# Altium project yard-ice.PrjPCB
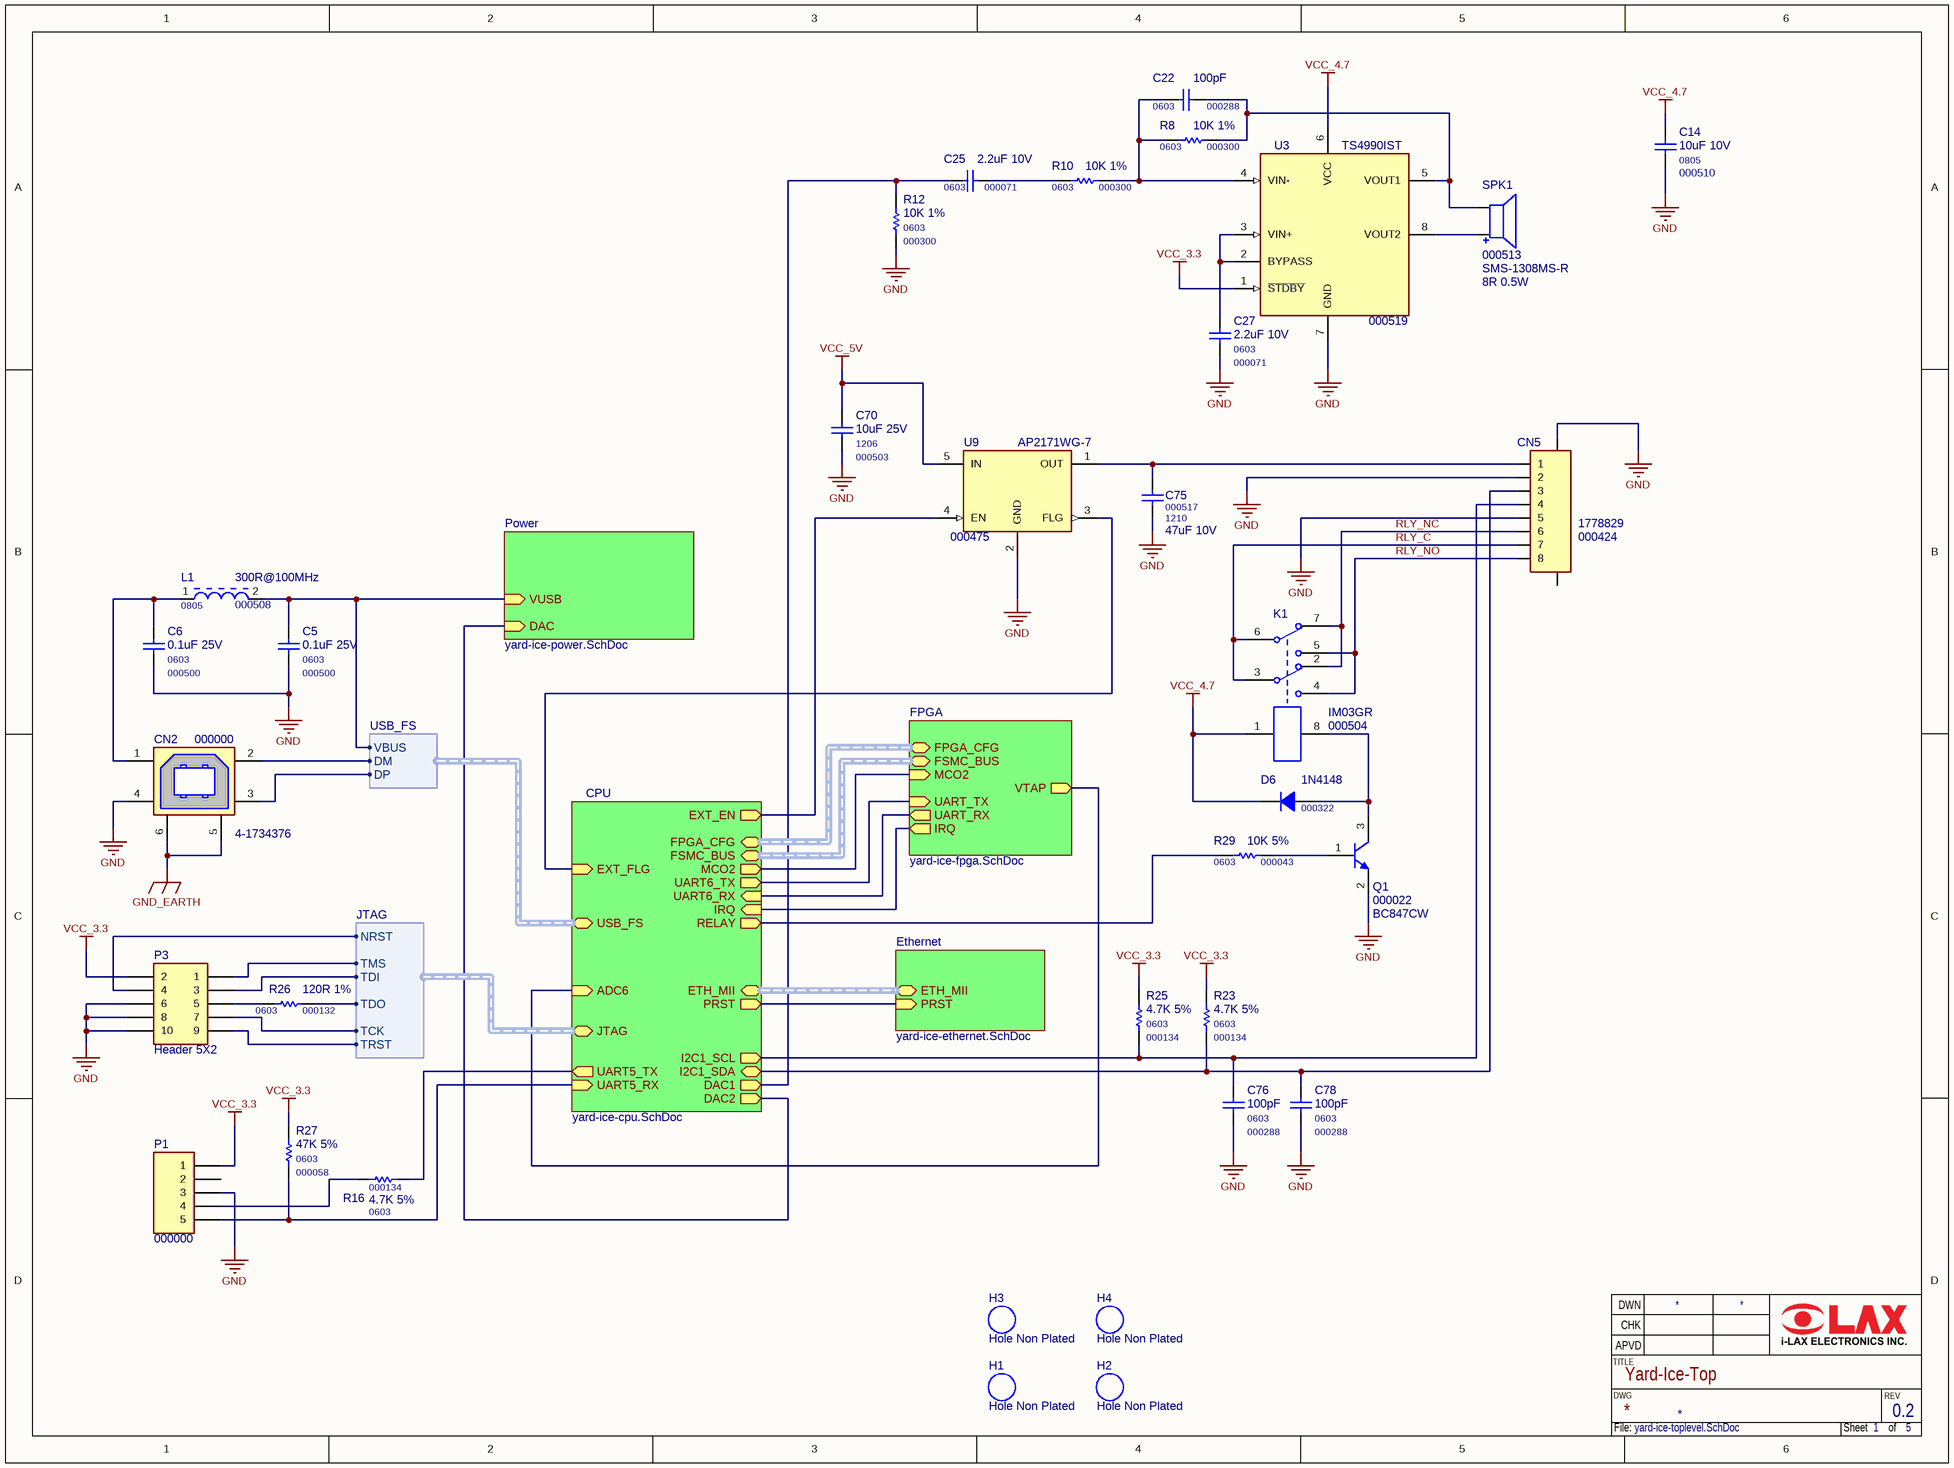
[diagram p0: yard-ice-toplevel.SchDoc]
5 sheets, 173 parts. Net scope: hierarchical (ports join the sheet entries above them; power ports are global).
Board file: yard-ice.PcbDoc
Sheets:
  yard-ice-toplevel.SchDoc
    Power = yard-ice-power.SchDoc
    CPU = yard-ice-cpu.SchDoc
    FPGA = yard-ice-fpga.SchDoc
    Ethernet = yard-ice-ethernet.SchDoc

## Sheet yard-ice-toplevel.SchDoc: Yard-Ice-Top
size 365 x 274 mm; Revision: 0.2; SheetNumber: 1; SheetTotal: 5

### Parts
C5  000500  value 0.1uF 25V  Package: 0603  [C0603M]
C6  000500  value 0.1uF 25V  Package: 0603  [C0603M]
C14  000510  value 10uF 10V  Package: 0805  [C0805M]
C22  000288  value 100pF  Package: 0603  [C0603M]
C25  000071  value 2.2uF 10V  Package: 0603  [C0603M]
C27  000071  value 2.2uF 10V  Package: 0603  [C0603M]
C70  000503  value 10uF 25V  Package: 1206  [C1206M]
C75  000517  value 47uF 10V  Package: 1210  [C1210M]
C76  000288  value 100pF  Package: 0603  [C0603M]
C78  000288  value 100pF  Package: 0603  [C0603M]
CN2  000000  value 4-1734376  [4-1734376]
CN5  000424  value 1778829  [1778829]
D6  000322  value 1N4148  [SOD-123]
H1  Hole Non Plated  [Hole NP 3.2x5.0x5.0]
H2  Hole Non Plated  [Hole NP 3.2x5.0x5.0]
H3  Hole Non Plated  [Hole NP 3.2x5.0x5.0]
H4  Hole Non Plated  [Hole NP 3.2x5.0x5.0]
K1  000504  value IM03GR  [Relay-10X6]
L1  000508  value 300R@100MHz  Package: 0805  [L0805M]
P1  000000  [TSW-105-07-G-S]
P3  Header 5X2  [TSW-105-07-G-D]
Q1  000022  value BC847CW  [SOT-323]
R8  000300  value 10K 1%  Package: 0603  [R0603M]
R10  000300  value 10K 1%  Package: 0603  [R0603M]
R12  000300  value 10K 1%  Package: 0603  [R0603M]
R16  000134  value 4.7K 5%  Package: 0603  [R0603M]
R23  000134  value 4.7K 5%  Package: 0603  [R0603M]
R25  000134  value 4.7K 5%  Package: 0603  [R0603M]
R26  000132  value 120R 1%  Package: 0603  [R0603M]
R27  000058  value 47K 5%  Package: 0603  [R0603M]
R29  000043  value 10K 5%  Package: 0603  [R0603M]
SPK1  000513  value 8R 0.5W  [SMS-1308MS-R]
U3  000519  value TS4990IST  [MiniSO-8M]
U9  000475  value AP2171WG-7  [SOT-25]

### Sub-sheets
CPU = yard-ice-cpu.SchDoc: ETH_MII (harness ETH_MII), FSMC_BUS (harness FSMC_BUS), FPGA_CFG (harness FPGA_CFG), PRST (out), MCO2 (out), USB_FS (harness USB_FS), JTAG (harness JTAG), EXT_EN (out), EXT_FLG (in), ADC6 (in), DAC2 (out), I2C1_SDA (bidir), I2C1_SCL (out), UART6_TX (out), UART6_RX (in), UART5_TX (out), UART5_RX (in), RELAY (out), IRQ (in), DAC1 (out)
Ethernet = yard-ice-ethernet.SchDoc: ETH_MII (harness ETH_MII), PRST (in)
FPGA = yard-ice-fpga.SchDoc: FSMC_BUS (harness FSMC_BUS), FPGA_CFG (harness FPGA_CFG), MCO2 (in), VTAP (out), UART_TX (in), UART_RX (out), IRQ (out)
Power = yard-ice-power.SchDoc: VUSB (in), DAC (in)

### Harnesses
USB_FS: VBUS, DM, DP
JTAG: TDO, TDI, TCK, TMS, TRST, NRST

### Nets
GND: C5.2 C6.2 C14.2 C27.2 C70.2 C75.2 C76.2 C78.2 CN2.4 CN5.2 CN5.5 CN5.9 P1.3 P3.6 P3.8 P3.10 Q1.2(E) R12.1 U3.7(GND) U9.2(GND)
GND_EARTH: CN2.5(SHIELD) CN2.6(SHIELD)
VCC_3.3: P1.1 P3.2 R23.2 R25.2 R27.2 U3.1(~{STDBY})
VCC_4.7: C14.1 D6.2(K) K1.1 U3.6(VCC)
VCC_5V: C70.1 U9.5(IN)
ADC12_IN6: sheet CPU/ADC6, sheet FPGA/VTAP
DAC1_OUT: C25.1 R12.2 ; sheet CPU/DAC1
DAC2_OUT: sheet Power/DAC, sheet CPU/DAC2
I2C1_SCL: C76.1 CN5.4 R25.1 ; sheet CPU/I2C1_SCL
I2C1_SDA: C78.1 CN5.3 R23.1 ; sheet CPU/I2C1_SDA
JTCK: P3.7 ; sheet CPU/JTAG.TCK
JTDI: P3.3 ; sheet CPU/JTAG.TDI
JTDO: R26.2 ; sheet CPU/JTAG.TDO
JTMS: P3.1 ; sheet CPU/JTAG.TMS
JTRST: P3.9 ; sheet CPU/JTAG.TRST
MCO2: sheet CPU/MCO2, sheet FPGA/MCO2
NRST: P3.4 ; sheet CPU/JTAG.NRST
OTG_FS_DM: CN2.2 ; sheet CPU/USB_FS.DM
OTG_FS_DP: CN2.3 ; sheet CPU/USB_FS.DP
OTG_FS_VBUS: C5.1 L1.2 ; sheet Power/VUSB, sheet CPU/USB_FS.VBUS
PD6: sheet CPU/IRQ, sheet FPGA/IRQ
PD11: U9.3(FLG) ; sheet CPU/EXT_FLG
PD12: U9.4(EN) ; sheet CPU/EXT_EN
PE5: sheet CPU/PRST, sheet Ethernet/PRST
RLY_C: CN5.7 K1.3 K1.6
RLY_NC: CN5.6 K1.2 K1.7
RLY_NO: CN5.8 K1.4 K1.5
SPI2_NSS: R29.2 ; sheet CPU/RELAY
USART5_RX: P1.5 R27.1 ; sheet CPU/UART5_RX
USART5_TX: R16.1 ; sheet CPU/UART5_TX
USART6_RX: sheet CPU/UART6_RX, sheet FPGA/UART_RX
USART6_TX: sheet CPU/UART6_TX, sheet FPGA/UART_TX
NetC6_1: C6.1 CN2.1 L1.1
NetC22_1: C22.1 R8.2 R10.1 U3.4(VIN-)
NetC22_2: C22.2 R8.1 SPK1.2 U3.5(VOUT1)
NetC25_2: C25.2 R10.2
NetC27_1: C27.1 U3.2(BYPASS) U3.3(VIN+)
NetC75_1: C75.1 CN5.1 U9.1(OUT)
NetD6_1: D6.1(A) K1.8 Q1.3(C)
NetP1_4: P1.4 R16.2
NetP3_5: P3.5 R26.1
NetQ1_1: Q1.1(B) R29.1
NetSPK1_1: SPK1.1 U3.8(VOUT2)

Not connected (* = marked no-connect by the designer): CN5 10; P1 2

### Buses and harness runs
harness sheet CPU/ETH_MII = sheet Ethernet/ETH_MII
harness sheet CPU/FPGA_CFG = sheet FPGA/FPGA_CFG
harness sheet CPU/FSMC_BUS = sheet FPGA/FSMC_BUS

### Notes on the sheet
- TITLE
- APVD
- DWN
- CHK
- DWG
- REV
- File:
- Sheet
- of

### Library data of the parts
C5 C6 = C0603: SMD Ceramic Chip Capacitor - 0603 - X7R; MF PN: C1608X7R1E104K; MF: TDK; PN: 000500
C14 = C0805: SMD Ceramic Chip Capacitor - 0805 - X7R; MF PN: C2012X7R1A106K; MF: TDK; PN: 000510
C22 C76 C78 = C0603: SMD Ceramic Chip Capacitor - 0603; PN: 000288
C25 = C0603: SMD Ceramic Chip Capacitor - 0603 - X7R; MF PN: LMK107B7225KA-T; MF: Taiyo Yuden; PN: 000071
C27 = C0603: SMD Ceramic Chip Capacitor - 0603 - X7R; MF: Taiyo Yuden; MF PN: LMK107B7225KA-T; PN: 000071
C70 = C1206: SMD Ceramic Chip Capacitor - 1206 - X7R; MF PN: TMK316B7106KL-TD; MF: Taiyo Yuden; PN: 000503
C75 = C12010: SMD Ceramic Chip Capacitor - 1210 - X7R; MF: Taiyo Yuden; MF PN: LMK325B7476MM-TR; PN: 000517
CN2 = 4-1734376: USB Type B - Right Angle - Thru Hole; MF: Tyco; PN: 000000; Package: PTH
CN5 = Combicon SMT 8: Terminal Block, Header, 8-Pos; MF: Phoenix Contacts; PN: 000424; Package: SMT
D6 = 1N4148W: Schottky Barrier Diode; MF: Diodes Inc; MF PN: 1N4148W-7-F; PN: 000322; Package: SOD-123
K1 = Relay-DPDT: Dual-Pole Dual-Throw Relay; MF: Tyco; PN: 000504; Package: SMT; MF PN: IM03GR
L1 = L0805: SMD Chip Inductor - 0805; MF PN: MMZ2012Y301B; MF: TDK; PN: 000508
P1 = Header 5: Header, 5-Pin; Value: 5x1; PN: 000000; Package: PTH
P3 = Header 5X2: Header 5-Pin, Dual row; PN: 000000; Package: PTH; Value: 5x2
Q1 = BC847CW: NPN General-purpose Transistor; MF: Diodes Inc; MF PN: BC847CW-7-F; PN: 000022; Package: SOT-323
R8 R10 R12 R16 R23 R25-R27 R29 = R0603: SMD Chip Resistor - 0603
  R8 R10 R12: PN: 000300
  R16 R23 R25: PN: 000134
  R26: PN: 000132
  R27: PN: 000058
  R29: PN: 000043
SPK1 = SMS-1308MS-R: Loudspeaker; MF: PUI-Audio; PN: 000513; Package: SMT; MF PN: SMS-1308MS-R
U3 = TS4990IST: 1.2 W audio power amplifier with active-low standby mode; PN: 000519; Package: TSSOP-8
U9 = AP2171W: 1A SINGLE CHANNEL CURRENT-LIMITED POWER  SWITCH; MF: Diodes Inc; Package: SOT23-5; PN: 000475

## Sheet yard-ice-power.SchDoc: Yard-Ice-Power
size 365 x 274 mm; Revision: 1.0; SheetNumber: 2; SheetTotal: 5
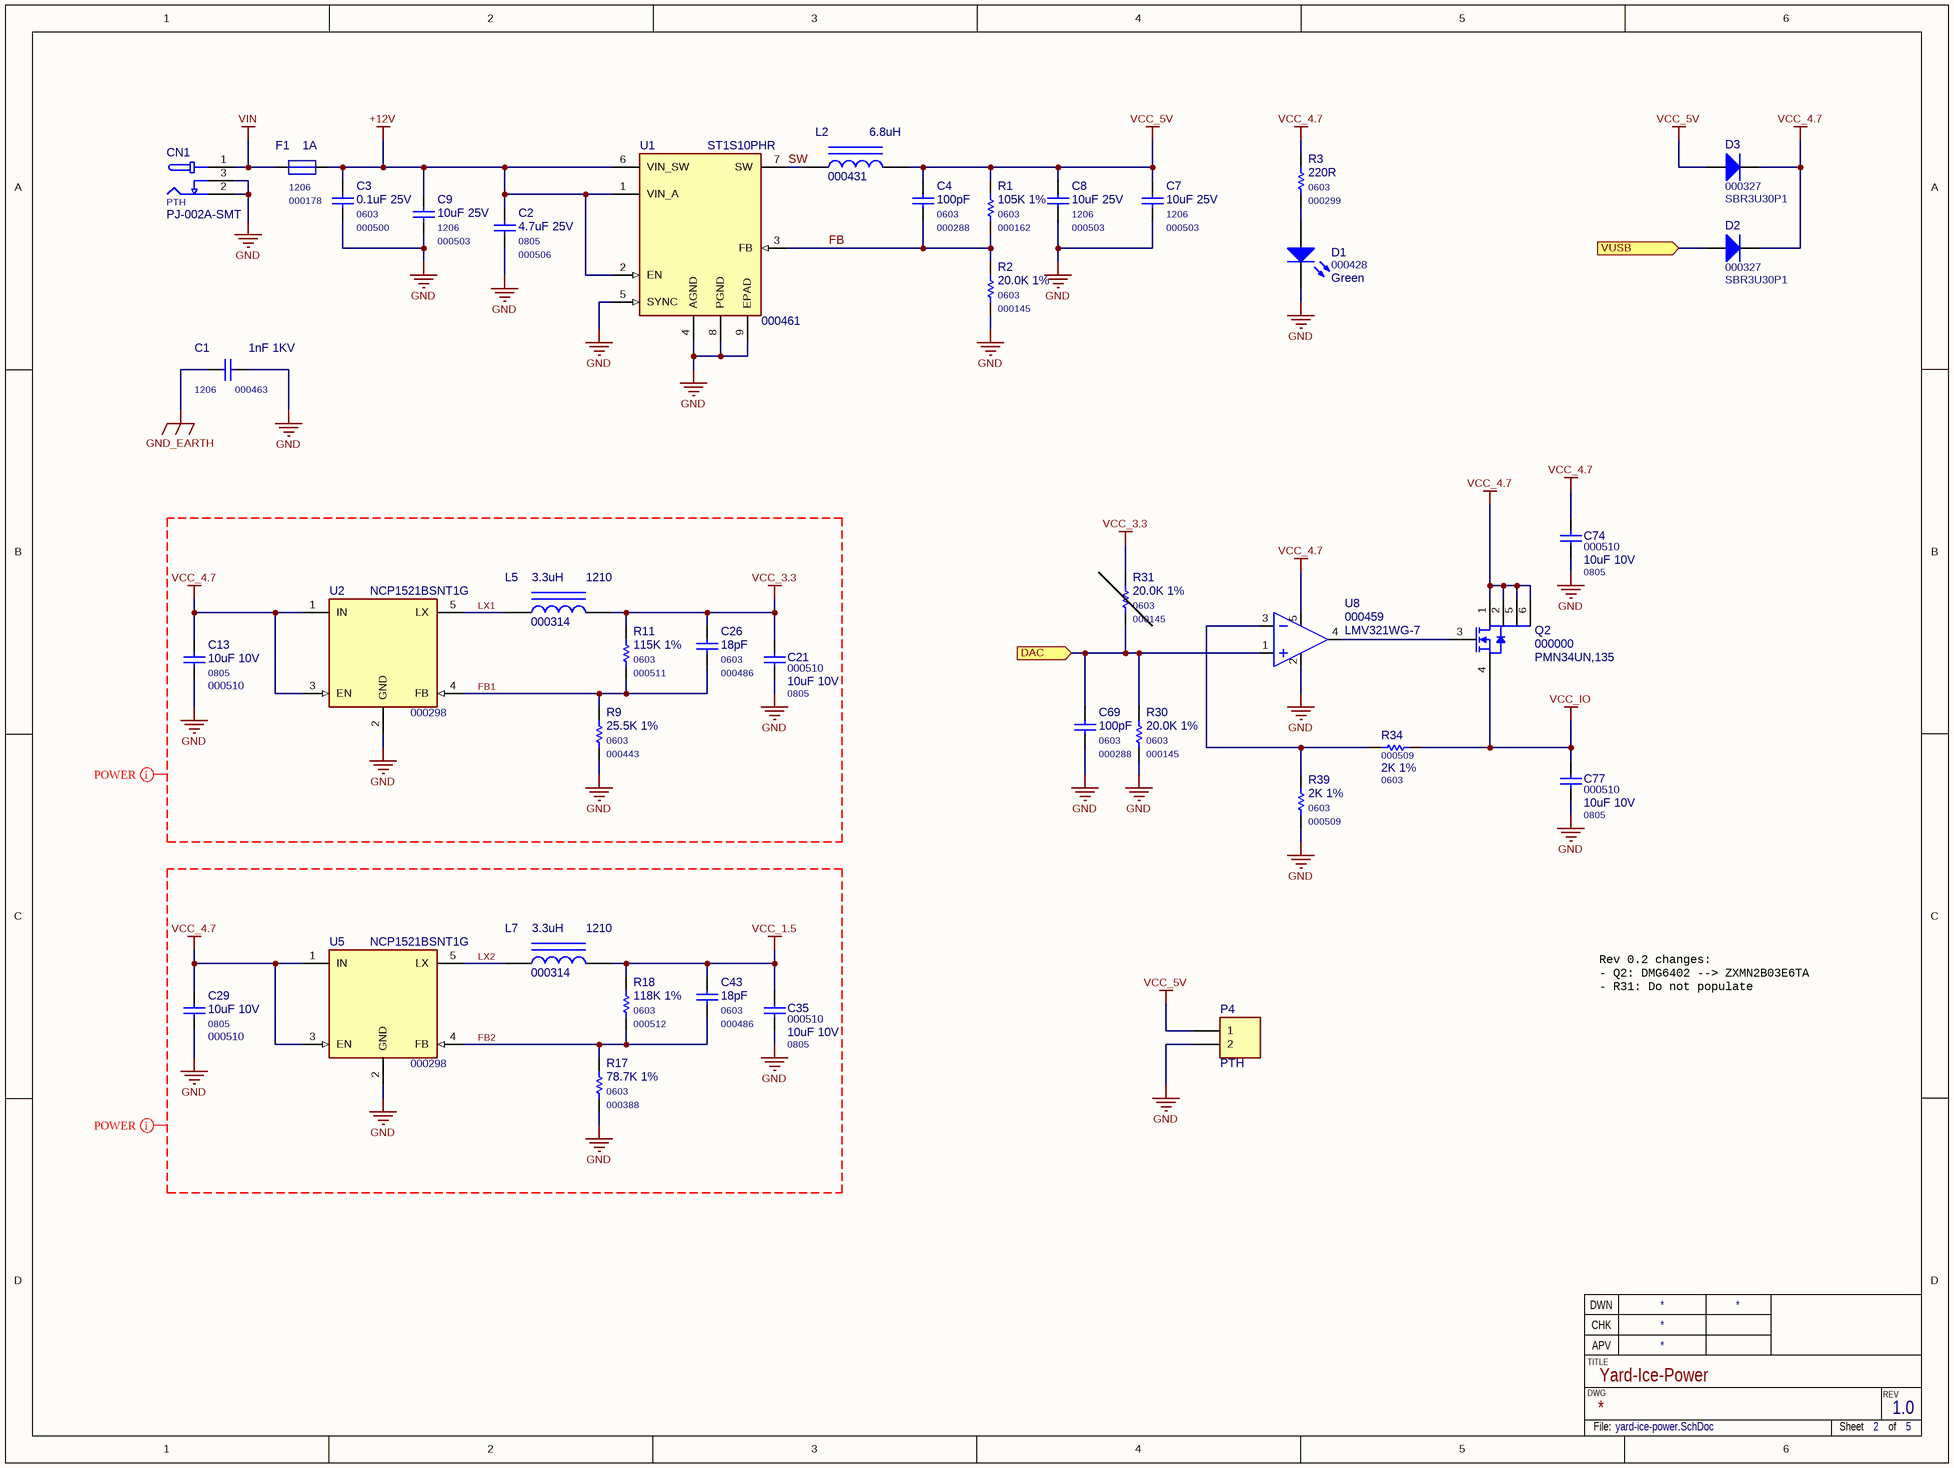
[diagram p1: yard-ice-power.SchDoc]

### Parts
C1  000463  value 1nF 1KV  Package: 1206  [C1206M]
C2  000506  value 4.7uF 25V  Package: 0805  [C0805M]
C3  000500  value 0.1uF 25V  Package: 0603  [C0603M]
C4  000288  value 100pF  Package: 0603  [C0603M]
C7  000503  value 10uF 25V  Package: 1206  [C1206M]
C8  000503  value 10uF 25V  Package: 1206  [C1206M]
C9  000503  value 10uF 25V  Package: 1206  [C1206M]
C13  000510  value 10uF 10V  Package: 0805  [C0805M]
C21  000510  value 10uF 10V  Package: 0805  [C0805M]
C26  000486  value 18pF  Package: 0603  [C0603M]
C29  000510  value 10uF 10V  Package: 0805  [C0805M]
C35  000510  value 10uF 10V  Package: 0805  [C0805M]
C43  000486  value 18pF  Package: 0603  [C0603M]
C69  000288  value 100pF  Package: 0603  [C0603M]
C74  000510  value 10uF 10V  Package: 0805  [C0805M]
C77  000510  value 10uF 10V  Package: 0805  [C0805M]
CN1  PTH  [PJ-002A-SMT]
D1  000428  value Green  [LED0805L LP]
D2  000327  value SBR3U30P1  [PowerDI 123]
D3  000327  value SBR3U30P1  [PowerDI 123]
F1  000178  value 1A  Package: 1206  [F1206L]
L2  000431  value 6.8uH  [L8.0MMX8.0MM]
L5  000314  value 3.3uH  Package: 1210  [L1210M]
L7  000314  value 3.3uH  Package: 1210  [L1210M]
P4  PTH  [TSW-102-07-G-S]
Q2  000000  value PMN34UN,135  [SOT-26]
R1  000162  value 105K 1%  Package: 0603  [R0603M]
R2  000145  value 20.0K 1%  Package: 0603  [R0603M]
R3  000299  value 220R  Package: 0603  [R0603M]
R9  000443  value 25.5K 1%  Package: 0603  [R0603M]
R11  000511  value 115K 1%  Package: 0603  [R0603M]
R17  000388  value 78.7K 1%  Package: 0603  [R0603M]
R18  000512  value 118K 1%  Package: 0603  [R0603M]
R30  000145  value 20.0K 1%  Package: 0603  [R0603M]
R31  000145  value 20.0K 1%  Package: 0603  [R0603M]
R34  000509  value 2K 1%  Package: 0603  [R0603M]
R39  000509  value 2K 1%  Package: 0603  [R0603M]
U1  000461  value ST1S10PHR  [PowerSO-8]
U2  000298  value NCP1521BSNT1G  [TSOP-5]
U5  000298  value NCP1521BSNT1G  [TSOP-5]
U8  000459  value LMV321WG-7  [SOT-25]

### Ports
DAC (in), VUSB (in)

### Nets
+12V: C2.1 C3.1 C9.1 F1.2 U1.1(VIN_A) U1.2(EN) U1.6(VIN_SW)
GND: C1.2 C2.2 C3.2 C7.2 C8.2 C9.2 C13.2 C21.2 C29.2 C35.2 C69.2 C74.2 C77.2 CN1.2 CN1.3 D1.2(K) P4.2 R2.1 R9.1 R17.1 R30.1 R39.1 U1.4(AGND) U1.5(SYNC) U1.8(PGND) U1.9(EPAD) U2.2(GND) U5.2(GND) U8.2(V-)
GND_EARTH: C1.1
VCC_1.5: C35.1 C43.1 L7.2 R18.2
VCC_3.3: C21.1 C26.1 L5.2 R11.2 R31.2
VCC_4.7: C13.1 C29.1 C74.1 D2.2(K) D3.2(K) Q2.1(D) Q2.2(D) Q2.5(D) Q2.6(D) R3.2 U2.1(IN) U2.3(EN) U5.1(IN) U5.3(EN) U8.5(V+)
VCC_5V: C4.1 C7.1 C8.1 D3.1(A) L2.2 P4.1 R1.2
VCC_IO: C77.1 Q2.4(S) R34.1
VIN: CN1.1 F1.1
DAC2_OUT: C69.1 R30.2 R31.1 U8.1(IN+) ; port DAC
FB: C4.2 R1.1 R2.2 U1.3(FB)
FB1: C26.2 R9.2 R11.1 U2.4(FB)
FB2: C43.2 R17.2 R18.1 U5.4(FB)
LX1: L5.1 U2.5(LX)
LX2: L7.1 U5.5(LX)
OTG_FS_VBUS: D2.1(A) ; port VUSB
SW: L2.1 U1.7(SW)
NetD1_1: D1.1(A) R3.1
NetQ2_3: Q2.3(G) U8.4(OUT)
NetR34_2: R34.2 R39.2 U8.3(IN-)

### Layout directives
net class POWER: FB1, FB2, GND, LX1, LX2, VCC_1.5, VCC_3.3, VCC_4.7

### Notes on the sheet
- Rev 0.2 changes:
  - Q2: DMG6402 --> ZXMN2B03E6TA
  - R31: Do not populate
- TITLE
- CHK
- DWN
- APV
- DWG
- REV
- File:
- Sheet
- of

### Library data of the parts
C1 = C1206: SMD Ceramic Chip Capacitor - 1206; PN: 000463
C2 = C0805: SMD Ceramic Chip Capacitor - 0805 - X7R; MF: Taiyo Yuden; MF PN: TMK212AB7475KG-T; PN: 000506
C3 = C0603: as C5 on sheet yard-ice-toplevel; PN: 000500
C4 C26 C43 C69 = C0603: SMD Ceramic Chip Capacitor - 0603
  C4 C69: PN: 000288
  C26 C43: PN: 000486
C7-C9 = C1206: as C70 on sheet yard-ice-toplevel; PN: 000503
C13 C21 C29 C35 = C0805: as C14 on sheet yard-ice-toplevel; PN: 000510
C74 C77 = C0805: SMD Ceramic Chip Capacitor - 0805 - X7R; MF PN: C2012X7R1A106K; PN: TDK; PN: 000510; MF: TDK
CN1 = PJ-002A-SMT: Low Voltage Power Supply Connector; MF: CUI INC; PN: PTH; MF PN: PJ-002A-SMT; Package: SMT; Value: PJ-002A-SMT
D1 = LED0805LP: LED SMD 0805; Package: 0805; PN: 000428
D2 D3 = SBR3U30P1: Super Barrier Rectifier; MF: Diodes Inc; PN: 000327; Package: PowerDI 123
F1 = F1206: SMD Fuse, 1A, Slow, 63VDC, 1206; MF: Bel Fuse Inc; MF PN: C1S 1; PN: 000178
L2 = L8.0X8.0: SMT Power Inductor 8.0X8.0mm; MF: Taiyo Yuden; MF PN: NRS8040T6R8NJGJ; PN: 000431; Package: 8.0x8.0mm
L5 L7 = L1210: SMD Wire Wound Inductor -  1210 (3225 metric); MF: Murata; MF PN: LQH32PN3R3NN0L; PN: 000314
P4 = Header 2: Header, 2-Pin; Value: 2x1; PN: PTH; Package: PTH
Q2 = PMN34UN,135: N-Channel MOSFET 30V 4.9A 6TSOP; PN: 000000; Package: SOT23-6; ExtraInfo: *
R1-R3 R9 R11 R17 R18 R30 R31 R34 R39 = R0603: SMD Chip Resistor - 0603
  R1: PN: 000162
  R2 R30 R31: PN: 000145
  R3: PN: 000299
  R9: PN: 000443
  R11: PN: 000511
  R17: PN: 000388
  R18: PN: 000512
  R34 R39: PN: 000509
U1 = ST1S10: 3A, 900kHZ, monolithic synchronous step-down regulator; MF: ST; PN: 000461; Package: SOIC-8
U2 U5 = NCP1521BSNT1G: 1.5 MHz, 600 mA Step-Down  DC-DC Converter; MF: ON Semiconductor; PN: 000298; Package: SOT-23-5
U8 = LMV321WG-7: General Purpose, Low Voltage, Rail-to-Rail Output Operational Amplifier; MF: Diodes Inc; Package: SOT25; PN: 000459

## Sheet yard-ice-cpu.SchDoc: Yard-Ice-CPU
size 365 x 274 mm; Revision: 0.2; SheetNumber: 3; SheetTotal: 5
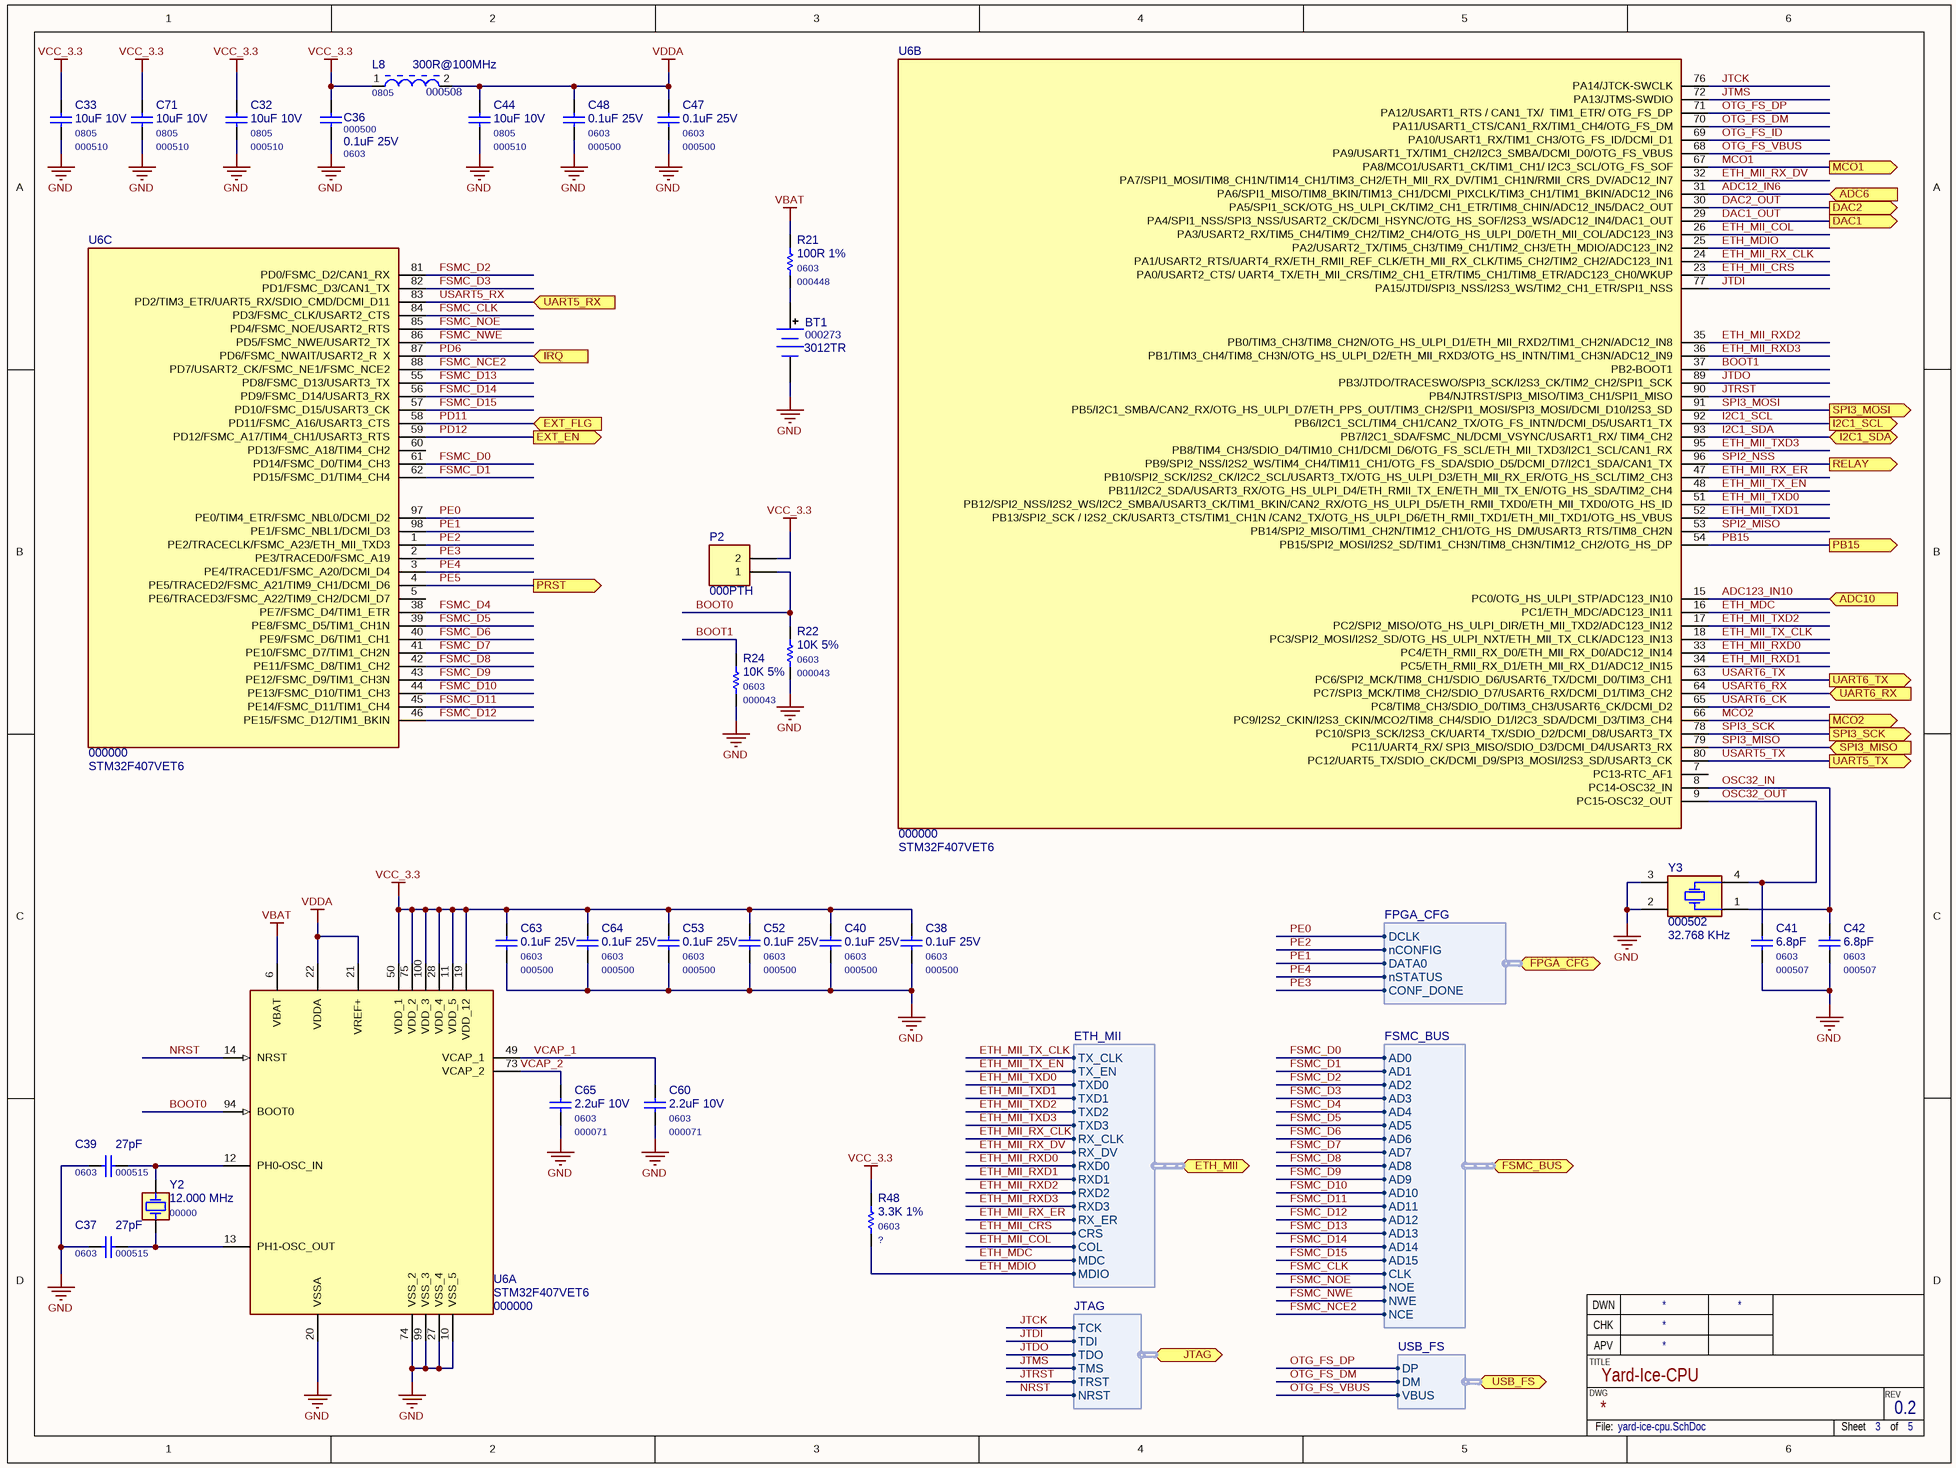
[diagram p2: yard-ice-cpu.SchDoc]

### Parts
BT1  000273  value 3012TR  [3012TR]
C32  000510  value 10uF 10V  Package: 0805  [C0805M]
C33  000510  value 10uF 10V  Package: 0805  [C0805M]
C36  000500  value 0.1uF 25V  Package: 0603  [C0603M]
C37  000515  value 27pF  Package: 0603  [C0603M]
C38  000500  value 0.1uF 25V  Package: 0603  [C0603M]
C39  000515  value 27pF  Package: 0603  [C0603M]
C40  000500  value 0.1uF 25V  Package: 0603  [C0603M]
C41  000507  value 6.8pF  Package: 0603  [C0603M]
C42  000507  value 6.8pF  Package: 0603  [C0603M]
C44  000510  value 10uF 10V  Package: 0805  [C0805M]
C47  000500  value 0.1uF 25V  Package: 0603  [C0603M]
C48  000500  value 0.1uF 25V  Package: 0603  [C0603M]
C52  000500  value 0.1uF 25V  Package: 0603  [C0603M]
C53  000500  value 0.1uF 25V  Package: 0603  [C0603M]
C60  000071  value 2.2uF 10V  Package: 0603  [C0603M]
C63  000500  value 0.1uF 25V  Package: 0603  [C0603M]
C64  000500  value 0.1uF 25V  Package: 0603  [C0603M]
C65  000071  value 2.2uF 10V  Package: 0603  [C0603M]
C71  000510  value 10uF 10V  Package: 0805  [C0805M]
L8  000508  value 300R@100MHz  Package: 0805  [L0805M]
P2  000PTH  [TSW-102-07-G-S]
R21  000448  value 100R 1%  Package: 0603  [R0603M]
R22  000043  value 10K 5%  Package: 0603  [R0603M]
R24  000043  value 10K 5%  Package: 0603  [R0603M]
R48  ?  value 3.3K 1%  Package: 0603  [R0603M]
U6  000000  value STM32F407VET6  [LQFP100]  (parts A,B,C of 3)
Y2  00000  value 12.000 MHz  [ABM3-H]
Y3  000502  value 32.768 KHz  [ABS25]

### Ports
ADC6 (in), ADC10 (in), DAC1 (out), DAC2 (out), ETH_MII (harness ETH_MII), EXT_EN (out), EXT_FLG (in), FPGA_CFG (harness FPGA_CFG), FSMC_BUS (harness FSMC_BUS), I2C1_SCL (out), I2C1_SDA (bidir), IRQ (in), JTAG (harness JTAG), MCO1 (out), MCO2 (out), PB15 (out), PRST (out), RELAY (out), SPI3_MISO (in), SPI3_MOSI (out), SPI3_SCK (out), UART5_RX (in), UART5_TX (out), UART6_RX (in), UART6_TX (out), USB_FS (harness USB_FS)

### Harnesses
ETH_MII: TX_CLK, TX_EN, TXD0, TXD1, TXD2, TXD3, RX_CLK, RX_DV, RXD0, RXD1, RXD2, RXD3, RX_ER, CRS, COL, MDC, MDIO
FSMC_BUS: AD0, AD1, AD2, AD3, AD4, AD5, AD6, AD7, AD8, AD9, AD10, AD11, AD12, AD13, AD14, AD15, CLK, NOE, NWE, NCE
FPGA_CFG: CONF_DONE, nSTATUS, DATA0, nCONFIG, DCLK
USB_FS: VBUS, DM, DP
JTAG: TDO, TDI, TCK, TMS, TRST, NRST

### Nets
GND: BT1.2(-) C32.2 C33.2 C36.2 C37.1 C38.2 C39.1 C40.2 C41.1 C42.1 C44.2 C47.2 C48.2 C52.2 C53.2 C60.2 C63.2 C64.2 C65.2 C71.2 R22.1 R24.1 U6.10(VSS_5) U6.20(VSSA) U6.27(VSS_4) U6.74(VSS_2) U6.99(VSS_3) Y3.2 Y3.3
VBAT: R21.2 U6.6(VBAT)
VCC_3.3: C32.1 C33.1 C36.1 C38.1 C40.1 C52.1 C53.1 C63.1 C64.1 C71.1 L8.1 P2.2 R48.2 U6.11(VDD_5) U6.19(VDD_12) U6.28(VDD_4) U6.50(VDD_1) U6.75(VDD_2) U6.100(VDD_3)
VDDA: C44.1 C47.1 C48.1 L8.2 U6.21(VREF+) U6.22(VDDA)
ADC12_IN6: U6.31(PA6/SPI1_MISO/TIM8_BKIN/TIM13_CH1/DCMI_PIXCLK/TIM3_CH1/TIM1_BKIN/ADC12_IN6) ; port ADC6
ADC123_IN10: U6.15(PC0/OTG_HS_ULPI_STP/ADC123_IN10) ; port ADC10
BOOT0: P2.1 R22.2 U6.94(BOOT0)
BOOT1: R24.2 U6.37(PB2-BOOT1)
DAC1_OUT: U6.29(PA4/SPI1_NSS/SPI3_NSS/USART2_CK/DCMI_HSYNC/OTG_HS_SOF/I2S3_WS/ADC12_IN4/DAC1_OUT) ; port DAC1
DAC2_OUT: U6.30(PA5/SPI1_SCK/OTG_HS_ULPI_CK/TIM2_CH1_ETR/TIM8_CHIN/ADC12_IN5/DAC2_OUT) ; port DAC2
ETH_MDC: U6.16(PC1/ETH_MDC/ADC123_IN11) ; port ETH_MII.MDC
ETH_MDIO: R48.1 U6.25(PA2/USART2_TX/TIM5_CH3/TIM9_CH1/TIM2_CH3/ETH_MDIO/ADC123_IN2) ; port ETH_MII.MDIO
ETH_MII_COL: U6.26(PA3/USART2_RX/TIM5_CH4/TIM9_CH2/TIM2_CH4/OTG_HS_ULPI_D0/ETH_MII_COL/ADC123_IN3) ; port ETH_MII.COL
ETH_MII_CRS: U6.23(PA0/USART2_CTS/_UART4_TX/ETH_MII_CRS/TIM2_CH1_ETR/TIM5_CH1/TIM8_ETR/ADC123_CH0/WKUP) ; port ETH_MII.CRS
ETH_MII_RX_CLK: U6.24(PA1/USART2_RTS/UART4_RX/ETH_RMII_REF_CLK/ETH_MII_RX_CLK/TIM5_CH2/TIM2_CH2/ADC123_IN1) ; port ETH_MII.RX_CLK
ETH_MII_RX_DV: U6.32(PA7/SPI1_MOSI/TIM8_CH1N/TIM14_CH1/TIM3_CH2/ETH_MII_RX_DV/TIM1_CH1N/RMII_CRS_DV/ADC12_IN7) ; port ETH_MII.RX_DV
ETH_MII_RX_ER: U6.47(PB10/SPI2_SCK/I2S2_CK/I2C2_SCL/USART3_TX/OTG_HS_ULPI_D3/ETH_MII_RX_ER/OTG_HS_SCL/TIM2_CH3) ; port ETH_MII.RX_ER
ETH_MII_RXD0: U6.33(PC4/ETH_RMII_RX_D0/ETH_MII_RX_D0/ADC12_IN14) ; port ETH_MII.RXD0
ETH_MII_RXD1: U6.34(PC5/ETH_RMII_RX_D1/ETH_MII_RX_D1/ADC12_IN15) ; port ETH_MII.RXD1
ETH_MII_RXD2: U6.35(PB0/TIM3_CH3/TIM8_CH2N/OTG_HS_ULPI_D1/ETH_MII_RXD2/TIM1_CH2N/ADC12_IN8) ; port ETH_MII.RXD2
ETH_MII_RXD3: U6.36(PB1/TIM3_CH4/TIM8_CH3N/OTG_HS_ULPI_D2/ETH_MII_RXD3/OTG_HS_INTN/TIM1_CH3N/ADC12_IN9) ; port ETH_MII.RXD3
ETH_MII_TX_CLK: U6.18(PC3/SPI2_MOSI/I2S2_SD/OTG_HS_ULPI_NXT/ETH_MII_TX_CLK/ADC123_IN13) ; port ETH_MII.TX_CLK
ETH_MII_TX_EN: U6.48(PB11/I2C2_SDA/USART3_RX/OTG_HS_ULPI_D4/ETH_RMII_TX_EN/ETH_MII_TX_EN/OTG_HS_SDA/TIM2_CH4) ; port ETH_MII.TX_EN
ETH_MII_TXD0: U6.51(PB12/SPI2_NSS/I2S2_WS/I2C2_SMBA/USART3_CK/TIM1_BKIN/CAN2_RX/OTG_HS_ULPI_D5/ETH_RMII_TXD0/ETH_MII_TXD0/OTG_HS_ID) ; port ETH_MII.TXD0
ETH_MII_TXD1: U6.52(PB13/SPI2_SCK_/_I2S2_CK/USART3_CTS/TIM1_CH1N_/CAN2_TX/OTG_HS_ULPI_D6/ETH_RMII_TXD1/ETH_MII_TXD1/OTG_HS_VBUS) ; port ETH_MII.TXD1
ETH_MII_TXD2: U6.17(PC2/SPI2_MISO/OTG_HS_ULPI_DIR/ETH_MII_TXD2/ADC123_IN12) ; port ETH_MII.TXD2
ETH_MII_TXD3: U6.95(PB8/TIM4_CH3/SDIO_D4/TIM10_CH1/DCMI_D6/OTG_FS_SCL/ETH_MII_TXD3/I2C1_SCL/CAN1_RX) ; port ETH_MII.TXD3
FSMC_CLK: U6.84(PD3/FSMC_CLK/USART2_CTS) ; port FSMC_BUS.CLK
FSMC_D0: U6.61(PD14/FSMC_D0/TIM4_CH3) ; port FSMC_BUS.AD0
FSMC_D1: U6.62(PD15/FSMC_D1/TIM4_CH4) ; port FSMC_BUS.AD1
FSMC_D2: U6.81(PD0/FSMC_D2/CAN1_RX) ; port FSMC_BUS.AD2
FSMC_D3: U6.82(PD1/FSMC_D3/CAN1_TX) ; port FSMC_BUS.AD3
FSMC_D4: U6.38(PE7/FSMC_D4/TIM1_ETR) ; port FSMC_BUS.AD4
FSMC_D5: U6.39(PE8/FSMC_D5/TIM1_CH1N) ; port FSMC_BUS.AD5
FSMC_D6: U6.40(PE9/FSMC_D6/TIM1_CH1) ; port FSMC_BUS.AD6
FSMC_D7: U6.41(PE10/FSMC_D7/TIM1_CH2N) ; port FSMC_BUS.AD7
FSMC_D8: U6.42(PE11/FSMC_D8/TIM1_CH2) ; port FSMC_BUS.AD8
FSMC_D9: U6.43(PE12/FSMC_D9/TIM1_CH3N) ; port FSMC_BUS.AD9
FSMC_D10: U6.44(PE13/FSMC_D10/TIM1_CH3) ; port FSMC_BUS.AD10
FSMC_D11: U6.45(PE14/FSMC_D11/TIM1_CH4) ; port FSMC_BUS.AD11
FSMC_D12: U6.46(PE15/FSMC_D12/TIM1_BKIN) ; port FSMC_BUS.AD12
FSMC_D13: U6.55(PD8/FSMC_D13/USART3_TX) ; port FSMC_BUS.AD13
FSMC_D14: U6.56(PD9/FSMC_D14/USART3_RX) ; port FSMC_BUS.AD14
FSMC_D15: U6.57(PD10/FSMC_D15/USART3_CK) ; port FSMC_BUS.AD15
FSMC_NCE2: U6.88(PD7/USART2_CK/FSMC_NE1/FSMC_NCE2) ; port FSMC_BUS.NCE
FSMC_NOE: U6.85(PD4/FSMC_NOE/USART2_RTS) ; port FSMC_BUS.NOE
FSMC_NWE: U6.86(PD5/FSMC_NWE/USART2_TX) ; port FSMC_BUS.NWE
I2C1_SCL: U6.92(PB6/I2C1_SCL/TIM4_CH1/CAN2_TX/OTG_FS_INTN/DCMI_D5/USART1_TX) ; port I2C1_SCL
I2C1_SDA: U6.93(PB7/I2C1_SDA/FSMC_NL/DCMI_VSYNC/USART1_RX/_TIM4_CH2) ; port I2C1_SDA
JTCK: U6.76(PA14/JTCK-SWCLK) ; port JTAG.TCK
JTDI: U6.77(PA15/JTDI/SPI3_NSS/I2S3_WS/TIM2_CH1_ETR/SPI1_NSS) ; port JTAG.TDI
JTDO: U6.89(PB3/JTDO/TRACESWO/SPI3_SCK/I2S3_CK/TIM2_CH2/SPI1_SCK) ; port JTAG.TDO
JTMS: U6.72(PA13/JTMS-SWDIO) ; port JTAG.TMS
JTRST: U6.90(PB4/NJTRST/SPI3_MISO/TIM3_CH1/SPI1_MISO) ; port JTAG.TRST
MCO1: U6.67(PA8/MCO1/USART1_CK/TIM1_CH1/_I2C3_SCL/OTG_FS_SOF) ; port MCO1
MCO2: U6.66(PC9/I2S2_CKIN/I2S3_CKIN/MCO2/TIM8_CH4/SDIO_D1/I2C3_SDA/DCMI_D3/TIM3_CH4) ; port MCO2
NRST: U6.14(NRST) ; port JTAG.NRST
OSC32_IN: C42.2 U6.8(PC14-OSC32_IN) Y3.1
OSC32_OUT: C41.2 U6.9(PC15-OSC32_OUT) Y3.4
OTG_FS_DM: U6.70(PA11/USART1_CTS/CAN1_RX/TIM1_CH4/OTG_FS_DM) ; port USB_FS.DM
OTG_FS_DP: U6.71(PA12/USART1_RTS_/_CAN1_TX/__TIM1_ETR/_OTG_FS_DP) ; port USB_FS.DP
OTG_FS_ID: U6.69(PA10/USART1_RX/TIM1_CH3/OTG_FS_ID/DCMI_D1)
OTG_FS_VBUS: U6.68(PA9/USART1_TX/TIM1_CH2/I2C3_SMBA/DCMI_D0/OTG_FS_VBUS) ; port USB_FS.VBUS
PB15: U6.54(PB15/SPI2_MOSI/I2S2_SD/TIM1_CH3N/TIM8_CH3N/TIM12_CH2/OTG_HS_DP) ; port PB15
PD6: U6.87(PD6/FSMC_NWAIT/USART2_R__X) ; port IRQ
PD11: U6.58(PD11/FSMC_A16/USART3_CTS) ; port EXT_FLG
PD12: U6.59(PD12/FSMC_A17/TIM4_CH1/USART3_RTS) ; port EXT_EN
PE0: U6.97(PE0/TIM4_ETR/FSMC_NBL0/DCMI_D2) ; port FPGA_CFG.DCLK
PE1: U6.98(PE1/FSMC_NBL1/DCMI_D3) ; port FPGA_CFG.DATA0
PE2: U6.1(PE2/TRACECLK/FSMC_A23/ETH_MII_TXD3) ; port FPGA_CFG.nCONFIG
PE3: U6.2(PE3/TRACED0/FSMC_A19) ; port FPGA_CFG.CONF_DONE
PE4: U6.3(PE4/TRACED1/FSMC_A20/DCMI_D4) ; port FPGA_CFG.nSTATUS
PE5: U6.4(PE5/TRACED2/FSMC_A21/TIM9_CH1/DCMI_D6) ; port PRST
SPI2_MISO: U6.53(PB14/SPI2_MISO/TIM1_CH2N/TIM12_CH1/OTG_HS_DM/USART3_RTS/TIM8_CH2N)
SPI2_NSS: U6.96(PB9/SPI2_NSS/I2S2_WS/TIM4_CH4/TIM11_CH1/OTG_FS_SDA/SDIO_D5/DCMI_D7/I2C1_SDA/CAN1_TX) ; port RELAY
SPI3_MISO: U6.79(PC11/UART4_RX/_SPI3_MISO/SDIO_D3/DCMI_D4/USART3_RX) ; port SPI3_MISO
SPI3_MOSI: U6.91(PB5/I2C1_SMBA/CAN2_RX/OTG_HS_ULPI_D7/ETH_PPS_OUT/TIM3_CH2/SPI1_MOSI/SPI3_MOSI/DCMI_D10/I2S3_SD) ; port SPI3_MOSI
SPI3_SCK: U6.78(PC10/SPI3_SCK/I2S3_CK/UART4_TX/SDIO_D2/DCMI_D8/USART3_TX) ; port SPI3_SCK
USART5_RX: U6.83(PD2/TIM3_ETR/UART5_RX/SDIO_CMD/DCMI_D11) ; port UART5_RX
USART5_TX: U6.80(PC12/UART5_TX/SDIO_CK/DCMI_D9/SPI3_MOSI/I2S3_SD/USART3_CK) ; port UART5_TX
USART6_CK: U6.65(PC8/TIM8_CH3/SDIO_D0/TIM3_CH3/USART6_CK/DCMI_D2)
USART6_RX: U6.64(PC7/SPI3_MCK/TIM8_CH2/SDIO_D7/USART6_RX/DCMI_D1/TIM3_CH2) ; port UART6_RX
USART6_TX: U6.63(PC6/SPI2_MCK/TIM8_CH1/SDIO_D6/USART6_TX/DCMI_D0/TIM3_CH1) ; port UART6_TX
VCAP_1: C60.1 U6.49(VCAP_1)
VCAP_2: C65.1 U6.73(VCAP_2)
NetBT1_1: BT1.1(+) R21.1
NetC37_2: C37.2 U6.13(PH1-OSC_OUT) Y2.2
NetC39_2: C39.2 U6.12(PH0-OSC_IN) Y2.1

Not connected (* = marked no-connect by the designer): U6 5(PE6/TRACED3/FSMC_A22/TIM9_CH2/DCMI_D7) 7(PC13-RTC_AF1) 60(PD13/FSMC_A18/TIM4_CH2)

### Notes on the sheet
- TITLE
- CHK
- DWN
- APV
- DWG
- REV
- File:
- Sheet
- of

### Library data of the parts
BT1 = 3012TR: CR1620 SMD Battery Holder; MF: Kestone; PN: 000273; Package: SMT
C32 C33 C71 = C0805: as C74 on sheet yard-ice-power; PN: 000510; MF: TDK
C36 C38 C40 C47 C48 C52 C53 C63 C64 = C0603: as C5 on sheet yard-ice-toplevel; PN: 000500
C37 C39 C41 C42 = C0603: SMD Ceramic Chip Capacitor - 0603
  C37 C39: PN: 000515
  C41 C42: PN: 000507
C44 = C0805: as C14 on sheet yard-ice-toplevel; PN: 000510
C60 C65 = C0603: as C27 on sheet yard-ice-toplevel; PN: 000071
L8 = L0805: SMD Ferrite Bead 0805; MF PN: MMZ2012Y301B; MF: TDK; PN: 000508
P2 = Header 2: Header, 2-Pin; Value: 2x1; PN: 000PTH; Package: PTH
R21 R22 R24 R48 = R0603: SMD Chip Resistor - 0603
  R21: PN: 000448
  R22 R24: PN: 000043
  R48: PN: ?
U6 = STM32F407VET6: Package: LQFP100; PN: 000000; ExtraInfo: *
Y2 = ABM3: Miniature Ceramic SMD Crystal; MF: Abracon; MF PN: ABM3-12.000MHZ-B2-T; Package: ABM3; PN: 00000
Y3 = ABS25: SMD Low Frequency Crystal; MF: Abracon; MF PN: ABS25-32.768KHZ-T; PN: 000502; Package: ABS25

## Sheet yard-ice-fpga.SchDoc: Yard-Ice-FPGA
size 365 x 274 mm; Revision: 0.2; SheetNumber: 4; SheetTotal: 5
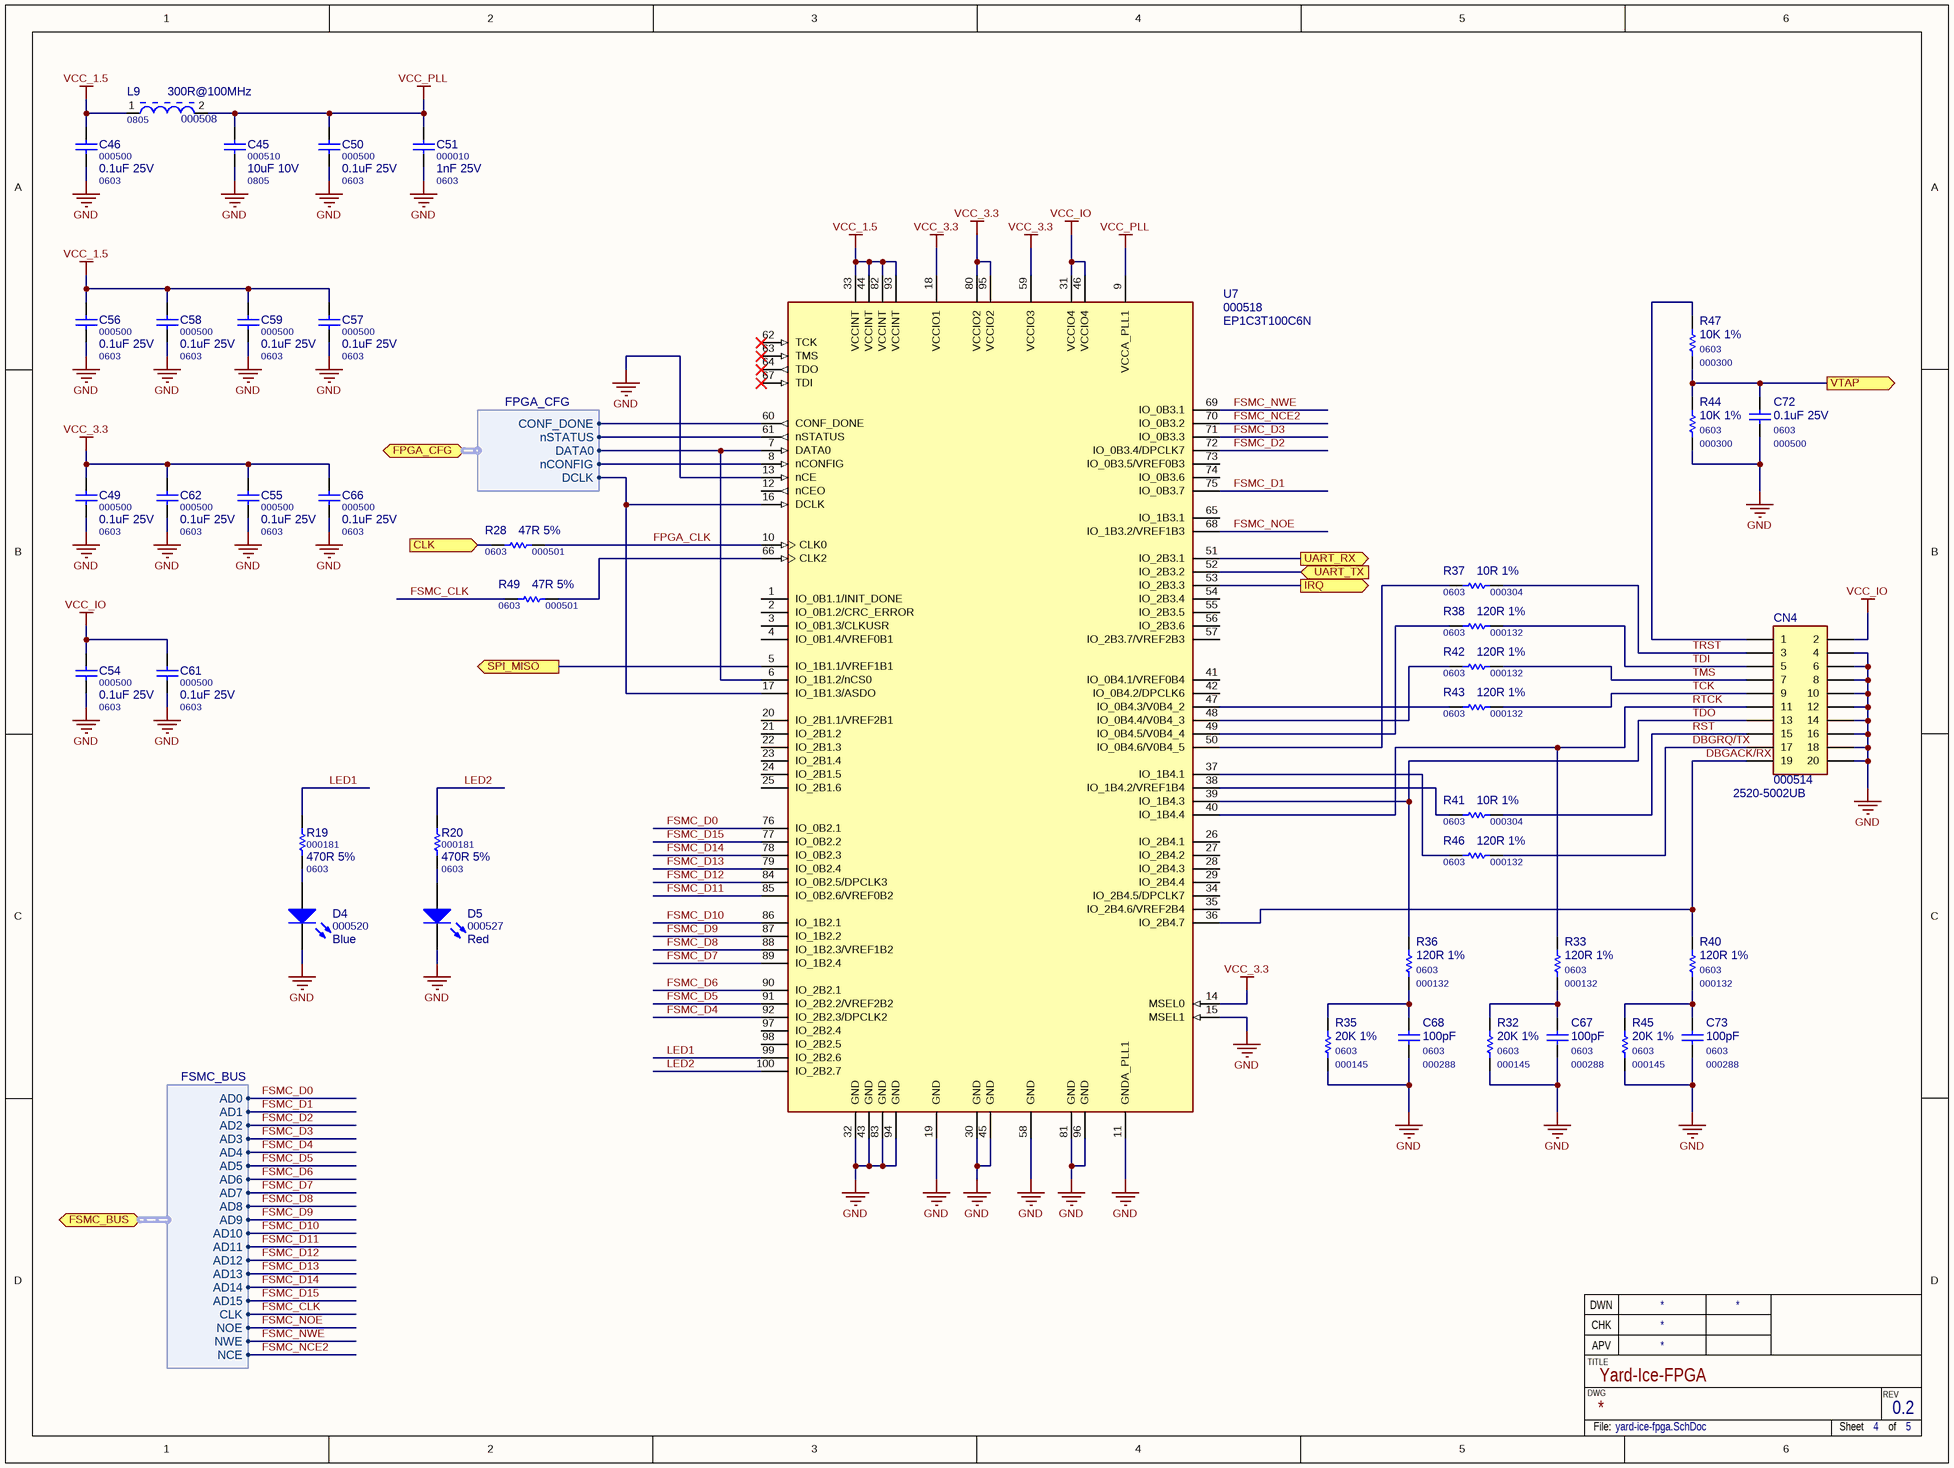
[diagram p3: yard-ice-fpga.SchDoc]

### Parts
C45  000510  value 10uF 10V  Package: 0805  [C0805M]
C46  000500  value 0.1uF 25V  Package: 0603  [C0603M]
C49  000500  value 0.1uF 25V  Package: 0603  [C0603M]
C50  000500  value 0.1uF 25V  Package: 0603  [C0603M]
C51  000010  value 1nF 25V  Package: 0603  [C0603M]
C54  000500  value 0.1uF 25V  Package: 0603  [C0603M]
C55  000500  value 0.1uF 25V  Package: 0603  [C0603M]
C56  000500  value 0.1uF 25V  Package: 0603  [C0603M]
C57  000500  value 0.1uF 25V  Package: 0603  [C0603M]
C58  000500  value 0.1uF 25V  Package: 0603  [C0603M]
C59  000500  value 0.1uF 25V  Package: 0603  [C0603M]
C61  000500  value 0.1uF 25V  Package: 0603  [C0603M]
C62  000500  value 0.1uF 25V  Package: 0603  [C0603M]
C66  000500  value 0.1uF 25V  Package: 0603  [C0603M]
C67  000288  value 100pF  Package: 0603  [C0603M]
C68  000288  value 100pF  Package: 0603  [C0603M]
C72  000500  value 0.1uF 25V  Package: 0603  [C0603M]
C73  000288  value 100pF  Package: 0603  [C0603M]
CN4  000514  value 2520-5002UB  [TST-110-04-G-D-RA]
D4  000520  value Blue  [LED0805L LP]
D5  000527  value Red  [LED0805L LP]
L9  000508  value 300R@100MHz  Package: 0805  [L0805M]
R19  000181  value 470R 5%  Package: 0603  [R0603M]
R20  000181  value 470R 5%  Package: 0603  [R0603M]
R28  000501  value 47R 5%  Package: 0603  [R0603M]
R32  000145  value 20K 1%  Package: 0603  [R0603M]
R33  000132  value 120R 1%  Package: 0603  [R0603M]
R35  000145  value 20K 1%  Package: 0603  [R0603M]
R36  000132  value 120R 1%  Package: 0603  [R0603M]
R37  000304  value 10R 1%  Package: 0603  [R0603M]
R38  000132  value 120R 1%  Package: 0603  [R0603M]
R40  000132  value 120R 1%  Package: 0603  [R0603M]
R41  000304  value 10R 1%  Package: 0603  [R0603M]
R42  000132  value 120R 1%  Package: 0603  [R0603M]
R43  000132  value 120R 1%  Package: 0603  [R0603M]
R44  000300  value 10K 1%  Package: 0603  [R0603M]
R45  000145  value 20K 1%  Package: 0603  [R0603M]
R46  000132  value 120R 1%  Package: 0603  [R0603M]
R47  000300  value 10K 1%  Package: 0603  [R0603M]
R49  000501  value 47R 5%  Package: 0603  [R0603M]
U7  000518  value EP1C3T100C6N  [TQFP-100]

### Ports
CLK (in), FPGA_CFG (harness FPGA_CFG), FSMC_BUS (harness FSMC_BUS), IRQ (out), SPI_MISO (out), UART_RX (out), UART_TX (in), VTAP (out)

### Harnesses
FSMC_BUS: AD0, AD1, AD2, AD3, AD4, AD5, AD6, AD7, AD8, AD9, AD10, AD11, AD12, AD13, AD14, AD15, CLK, NOE, NWE, NCE
FPGA_CFG: CONF_DONE, nSTATUS, DATA0, nCONFIG, DCLK

### Nets
GND: C45.2 C46.2 C49.2 C50.2 C51.2 C54.2 C55.2 C56.2 C57.2 C58.2 C59.2 C61.2 C62.2 C66.2 C67.2 C68.2 C72.2 C73.2 CN4.4 CN4.6 CN4.8 CN4.10 CN4.12 CN4.14 CN4.16 CN4.18 CN4.20 D4.2(K) D5.2(K) R32.2 R35.2 R44.2 R45.2 U7.11(GNDA_PLL1) U7.13(nCE) U7.15(MSEL1) U7.19(GND) U7.30(GND) U7.32(GND) U7.43(GND) U7.45(GND) U7.58(GND) U7.81(GND) U7.83(GND) U7.94(GND) U7.96(GND)
VCC_1.5: C46.1 C56.1 C57.1 C58.1 C59.1 L9.1 U7.33(VCCINT) U7.44(VCCINT) U7.82(VCCINT) U7.93(VCCINT)
VCC_3.3: C49.1 C55.1 C62.1 C66.1 U7.14(MSEL0) U7.18(VCCIO1) U7.59(VCCIO3) U7.80(VCCIO2) U7.95(VCCIO2)
VCC_IO: C54.1 C61.1 CN4.2 U7.31(VCCIO4) U7.46(VCCIO4)
VCC_PLL: C45.1 C50.1 C51.1 L9.2 U7.9(VCCA_PLL1)
ADC12_IN6: C72.1 R44.1 R47.2 ; port VTAP
DBGACK/RX: CN4.19 R40.1 U7.36(IO_2B4.7)
DBGRQ/TX: CN4.17 R46.1
FPGA_CLK: R28.1 U7.10(CLK0)
FSMC_CLK: R49.2 ; port FSMC_BUS.CLK
FSMC_D0: U7.76(IO_0B2.1) ; port FSMC_BUS.AD0
FSMC_D1: U7.75(IO_0B3.7) ; port FSMC_BUS.AD1
FSMC_D2: U7.72(IO_0B3.4/DPCLK7) ; port FSMC_BUS.AD2
FSMC_D3: U7.71(IO_0B3.3) ; port FSMC_BUS.AD3
FSMC_D4: U7.92(IO_2B2.3/DPCLK2) ; port FSMC_BUS.AD4
FSMC_D5: U7.91(IO_2B2.2/VREF2B2) ; port FSMC_BUS.AD5
FSMC_D6: U7.90(IO_2B2.1) ; port FSMC_BUS.AD6
FSMC_D7: U7.89(IO_1B2.4) ; port FSMC_BUS.AD7
FSMC_D8: U7.88(IO_1B2.3/VREF1B2) ; port FSMC_BUS.AD8
FSMC_D9: U7.87(IO_1B2.2) ; port FSMC_BUS.AD9
FSMC_D10: U7.86(IO_1B2.1) ; port FSMC_BUS.AD10
FSMC_D11: U7.85(IO_0B2.6/VREF0B2) ; port FSMC_BUS.AD11
FSMC_D12: U7.84(IO_0B2.5/DPCLK3) ; port FSMC_BUS.AD12
FSMC_D13: U7.79(IO_0B2.4) ; port FSMC_BUS.AD13
FSMC_D14: U7.78(IO_0B2.3) ; port FSMC_BUS.AD14
FSMC_D15: U7.77(IO_0B2.2) ; port FSMC_BUS.AD15
FSMC_NCE2: U7.70(IO_0B3.2) ; port FSMC_BUS.NCE
FSMC_NOE: U7.68(IO_1B3.2/VREF1B3) ; port FSMC_BUS.NOE
FSMC_NWE: U7.69(IO_0B3.1) ; port FSMC_BUS.NWE
LED1: R19.1 U7.99(IO_2B2.6)
LED2: R20.1 U7.100(IO_2B2.7)
PD6: U7.53(IO_2B3.3) ; port IRQ
PE0: U7.16(DCLK) U7.17(IO_1B1.3/ASDO) ; port FPGA_CFG.DCLK
PE1: U7.6(IO_1B1.2/nCS0) U7.7(DATA0) ; port FPGA_CFG.DATA0
PE2: U7.8(nCONFIG) ; port FPGA_CFG.nCONFIG
PE3: U7.60(CONF_DONE) ; port FPGA_CFG.CONF_DONE
PE4: U7.61(nSTATUS) ; port FPGA_CFG.nSTATUS
RST: CN4.15 R41.1
RTCK: CN4.11 R33.1 U7.40(IO_1B4.4)
TCK: CN4.9 R43.1
TDI: CN4.5 R38.1
TDO: CN4.13 R36.1 U7.39(IO_1B4.3)
TMS: CN4.7 R42.1
TRST: CN4.3 R37.1
USART6_RX: U7.51(IO_2B3.1) ; port UART_RX
USART6_TX: U7.52(IO_2B3.2) ; port UART_TX
NetC67_1: C67.1 R32.1 R33.2
NetC68_1: C68.1 R35.1 R36.2
NetC73_1: C73.1 R40.2 R45.1
NetCN4_1: CN4.1 R47.1
NetD4_1: D4.1(A) R19.2
NetD5_1: D5.1(A) R20.2
NetR28_2: R28.2 ; port CLK
NetR37_2: R37.2 U7.50(IO_0B4.6/V0B4_5)
NetR38_2: R38.2 U7.49(IO_0B4.5/V0B4_4)
NetR41_2: R41.2 U7.38(IO_1B4.2/VREF1B4)
NetR42_2: R42.2 U7.48(IO_0B4.4/V0B4_3)
NetR43_2: R43.2 U7.47(IO_0B4.3/V0B4_2)
NetR46_2: R46.2 U7.37(IO_1B4.1)
NetR49_1: R49.1 U7.66(CLK2)
NetU7_5: U7.5(IO_1B1.1/VREF1B1) ; port SPI_MISO

Not connected (* = marked no-connect by the designer): U7 1(IO_0B1.1/INIT_DONE) 2(IO_0B1.2/CRC_ERROR) 3(IO_0B1.3/CLKUSR) 4(IO_0B1.4/VREF0B1) 12(nCEO) 20(IO_2B1.1/VREF2B1) 21(IO_2B1.2) 22(IO_2B1.3) 23(IO_2B1.4) 24(IO_2B1.5) 25(IO_2B1.6) 26(IO_2B4.1) 27(IO_2B4.2) 28(IO_2B4.3) 29(IO_2B4.4) 34(IO_2B4.5/DPCLK7) 35(IO_2B4.6/VREF2B4) 41(IO_0B4.1/VREF0B4) 42(IO_0B4.2/DPCLK6) 54(IO_2B3.4) 55(IO_2B3.5) 56(IO_2B3.6) 57(IO_2B3.7/VREF2B3) 62(TCK)* 63(TMS)* 64(TDO)* 65(IO_1B3.1) 67(TDI)* 73(IO_0B3.5/VREF0B3) 74(IO_0B3.6) 97(IO_2B2.4) 98(IO_2B2.5)

### Notes on the sheet
- TITLE
- CHK
- DWN
- APV
- DWG
- REV
- File:
- Sheet
- of

### Library data of the parts
C45 = C0805: as C14 on sheet yard-ice-toplevel; PN: 000510
C46 C49 C50 C54-C59 C61 C62 C66 C72 = C0603: as C5 on sheet yard-ice-toplevel; PN: 000500
C51 = C0603: SMD Ceramic Chip Capacitor - 0603 - X7R; PN: 000010
C67 C68 C73 = C0603: SMD Ceramic Chip Capacitor - 0603; PN: 000288
CN4 = Header 10X2: Shrouded Header, 20 Pos, Right Angle; MF: 3M; PN: 000514; Package: PTH; MF PN: 2520-5002UB
D4 D5 = LED0805LP: LED SMD 0805; Package: 0805
  D4: PN: 000520
  D5: PN: 000527
L9 = L0805: as L8 on sheet yard-ice-cpu; PN: 000508
R19 R20 R28 R32 R33 R35-R38 R40-R47 R49 = R0603: SMD Chip Resistor - 0603
  R19 R20: PN: 000181
  R28 R49: PN: 000501
  R32 R35 R45: PN: 000145
  R33 R36 R38 R40 R42 R43 R46: PN: 000132
  R37 R41: PN: 000304
  R44 R47: PN: 000300
U7 = EP1C3T100C8N: Cyclone FPGA; MF: Altera; Package: 100-TQFP; PN: 000518; MF PN: EP1C3T100C6N

## Sheet yard-ice-ethernet.SchDoc: Yard-Ice-Ethernet
size 365 x 274 mm; Revision: 1.0; SheetNumber: 5; SheetTotal: 5
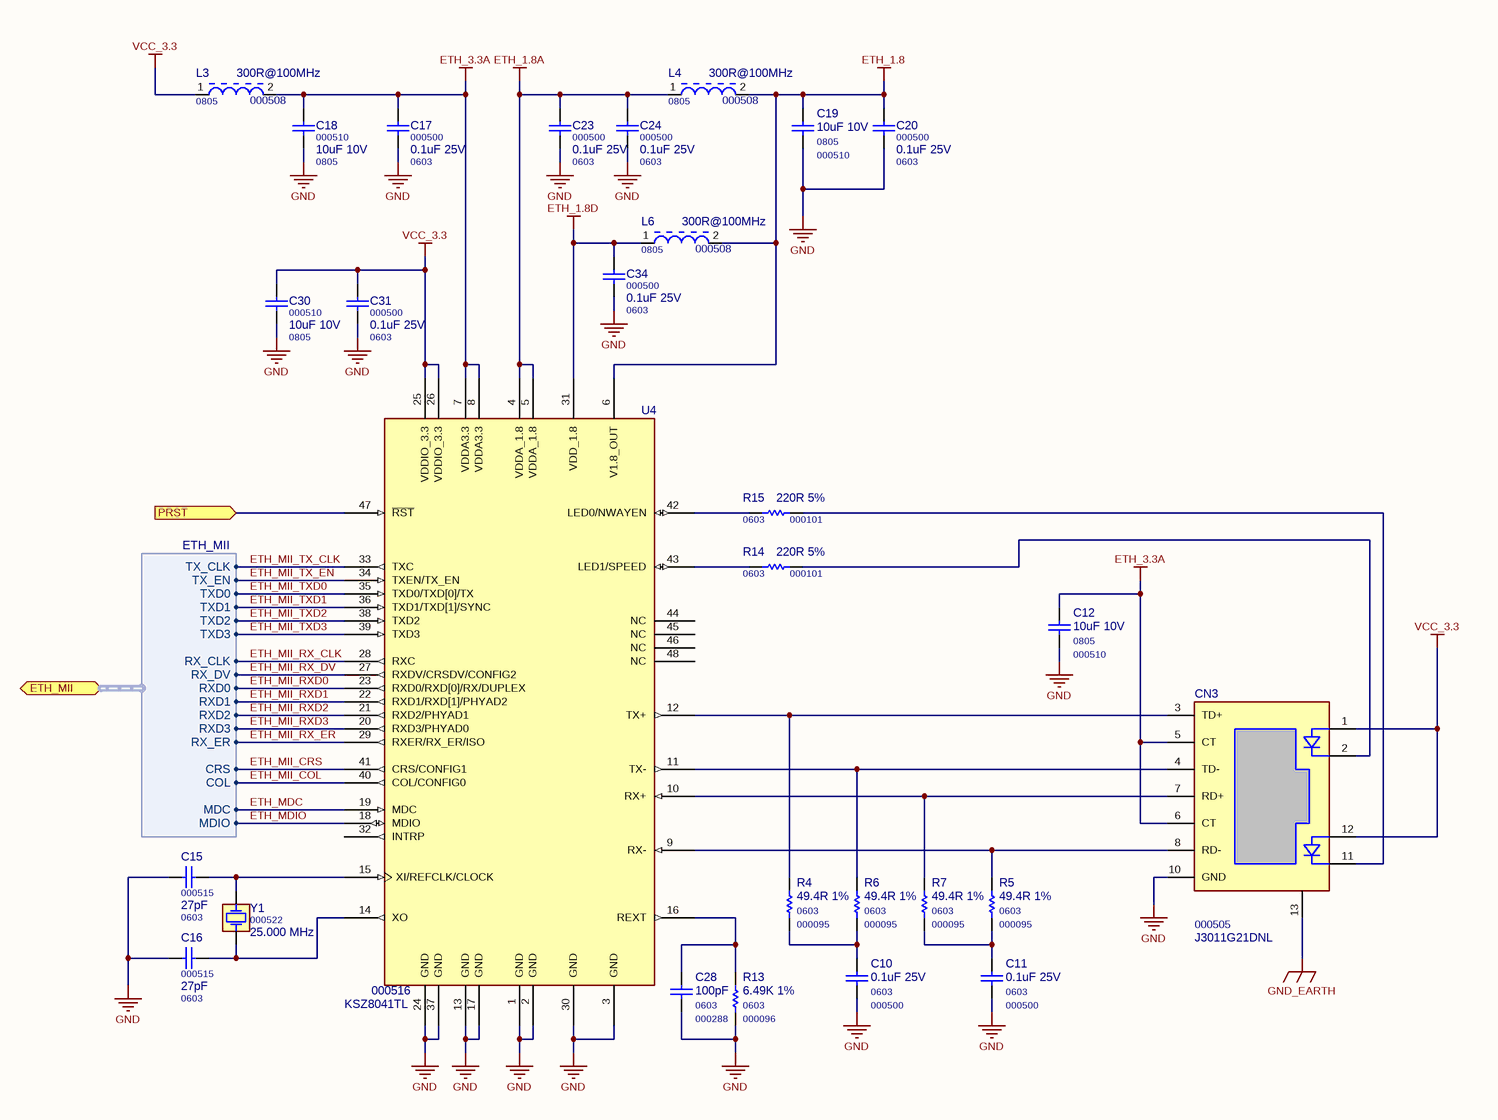
[diagram p4: yard-ice-ethernet.SchDoc]

### Parts
C10  000500  value 0.1uF 25V  Package: 0603  [C0603M]
C11  000500  value 0.1uF 25V  Package: 0603  [C0603M]
C12  000510  value 10uF 10V  Package: 0805  [C0805M]
C15  000515  value 27pF  Package: 0603  [C0603M]
C16  000515  value 27pF  Package: 0603  [C0603M]
C17  000500  value 0.1uF 25V  Package: 0603  [C0603M]
C18  000510  value 10uF 10V  Package: 0805  [C0805M]
C19  000510  value 10uF 10V  Package: 0805  [C0805M]
C20  000500  value 0.1uF 25V  Package: 0603  [C0603M]
C23  000500  value 0.1uF 25V  Package: 0603  [C0603M]
C24  000500  value 0.1uF 25V  Package: 0603  [C0603M]
C28  000288  value 100pF  Package: 0603  [C0603M]
C30  000510  value 10uF 10V  Package: 0805  [C0805M]
C31  000500  value 0.1uF 25V  Package: 0603  [C0603M]
C34  000500  value 0.1uF 25V  Package: 0603  [C0603M]
CN3  000505  value J3011G21DNL  [MOD-J3]
L3  000508  value 300R@100MHz  Package: 0805  [L0805M]
L4  000508  value 300R@100MHz  Package: 0805  [L0805M]
L6  000508  value 300R@100MHz  Package: 0805  [L0805M]
R4  000095  value 49.4R 1%  Package: 0603  [R0603M]
R5  000095  value 49.4R 1%  Package: 0603  [R0603M]
R6  000095  value 49.4R 1%  Package: 0603  [R0603M]
R7  000095  value 49.4R 1%  Package: 0603  [R0603M]
R13  000096  value 6.49K 1%  Package: 0603  [R0603M]
R14  000101  value 220R 5%  Package: 0603  [R0603M]
R15  000101  value 220R 5%  Package: 0603  [R0603M]
U4  000516  value KSZ8041TL  [48-TQFP]
Y1  000522  value 25.000 MHz  [ABM3-H]

### Ports
ETH_MII (harness ETH_MII), PRST (in)

### Harnesses
ETH_MII: TX_CLK, TX_EN, TXD0, TXD1, TXD2, TXD3, RX_CLK, RX_DV, RXD0, RXD1, RXD2, RXD3, RX_ER, CRS, COL, MDC, MDIO

### Nets
ETH_1.8: C19.1 C20.1 L4.2 L6.2 U4.6(V1.8_OUT)
ETH_1.8A: C23.1 C24.1 L4.1 U4.4(VDDA_1.8) U4.5(VDDA_1.8)
ETH_1.8D: C34.1 L6.1 U4.31(VDD_1.8)
ETH_3.3A: C12.1 C17.1 C18.1 CN3.5(CT) CN3.6(CT) L3.2 U4.7(VDDA3.3) U4.8(VDDA3.3)
GND: C10.2 C11.2 C12.2 C15.1 C16.1 C17.2 C18.2 C19.2 C20.2 C23.2 C24.2 C28.2 C30.2 C31.2 C34.2 CN3.10(GND) R13.1 U4.1(GND) U4.2(GND) U4.3(GND) U4.13(GND) U4.17(GND) U4.24(GND) U4.30(GND) U4.37(GND)
GND_EARTH: CN3.13(SHIELD)
VCC_3.3: C30.1 C31.1 CN3.1(A2) CN3.12(A1) L3.1 U4.25(VDDIO_3.3) U4.26(VDDIO_3.3)
ETH_MDC: U4.19(MDC) ; port ETH_MII.MDC
ETH_MDIO: U4.18(MDIO) ; port ETH_MII.MDIO
ETH_MII_COL: U4.40(COL/CONFIG0) ; port ETH_MII.COL
ETH_MII_CRS: U4.41(CRS/CONFIG1) ; port ETH_MII.CRS
ETH_MII_RX_CLK: U4.28(RXC) ; port ETH_MII.RX_CLK
ETH_MII_RX_DV: U4.27(RXDV/CRSDV/CONFIG2) ; port ETH_MII.RX_DV
ETH_MII_RX_ER: U4.29(RXER/RX_ER/ISO) ; port ETH_MII.RX_ER
ETH_MII_RXD0: U4.23(RXD0/RXD[0]/RX/DUPLEX) ; port ETH_MII.RXD0
ETH_MII_RXD1: U4.22(RXD1/RXD[1]/PHYAD2) ; port ETH_MII.RXD1
ETH_MII_RXD2: U4.21(RXD2/PHYAD1) ; port ETH_MII.RXD2
ETH_MII_RXD3: U4.20(RXD3/PHYAD0) ; port ETH_MII.RXD3
ETH_MII_TX_CLK: U4.33(TXC) ; port ETH_MII.TX_CLK
ETH_MII_TX_EN: U4.34(TXEN/TX_EN) ; port ETH_MII.TX_EN
ETH_MII_TXD0: U4.35(TXD0/TXD[0]/TX) ; port ETH_MII.TXD0
ETH_MII_TXD1: U4.36(TXD1/TXD[1]/SYNC) ; port ETH_MII.TXD1
ETH_MII_TXD2: U4.38(TXD2) ; port ETH_MII.TXD2
ETH_MII_TXD3: U4.39(TXD3) ; port ETH_MII.TXD3
PE5: U4.47(~{RST}) ; port PRST
NetC10_1: C10.1 R4.1 R6.1
NetC11_1: C11.1 R5.1 R7.1
NetC15_2: C15.2 U4.15(XI/REFCLK/CLOCK) Y1.1
NetC16_2: C16.2 U4.14(XO) Y1.2
NetC28_1: C28.1 R13.2 U4.16(REXT)
NetCN3_2: CN3.2(K2) R14.1
NetCN3_3: CN3.3(TD+) R4.2 U4.12(TX+)
NetCN3_4: CN3.4(TD-) R6.2 U4.11(TX-)
NetCN3_7: CN3.7(RD+) R7.2 U4.10(RX+)
NetCN3_8: CN3.8(RD-) R5.2 U4.9(RX-)
NetCN3_11: CN3.11(K1) R15.1
NetR14_2: R14.2 U4.43(LED1/SPEED)
NetR15_2: R15.2 U4.42(LED0/NWAYEN)

Not connected (* = marked no-connect by the designer): U4 32(INTRP) 44(NC) 45(NC) 46(NC) 48(NC)

### Notes on the sheet
- TITLE
- CHK
- DWN
- APV
- DWG
- REV
- File:
- Sheet
- of

### Library data of the parts
C10 C11 C17 C20 C23 C24 C31 C34 = C0603: as C5 on sheet yard-ice-toplevel; PN: 000500
C12 C18 C19 C30 = C0805: as C14 on sheet yard-ice-toplevel; PN: 000510
C15 C16 C28 = C0603: SMD Ceramic Chip Capacitor - 0603
  C15 C16: PN: 000515
  C28: PN: 000288
CN3 = J3011G21DNL: 10/100Base-TX surface mount RJ45; MF: Pulse; Package: SMT; PN: 000505
L3 L4 L6 = L0805: as L8 on sheet yard-ice-cpu; PN: 000508
R4-R7 R13-R15 = R0603: SMD Chip Resistor - 0603
  R4-R7: PN: 000095
  R13: PN: 000096
  R14 R15: PN: 000101
U4 = KSZ8041TL: 10Base-T/100Base-TX Physical Layer Transceiver; MF: Micrel; PN: 000516; Package: 48-TQFP
Y1 = ABM3: Miniature Ceramic SMD Crystal; MF: Abracon; MF PN: ABM3-25.000MHZ-B2-T; Package: ABM3; PN: 000522

## Nets that join several sheets
GND: yard-ice-toplevel (20 pins), yard-ice-power (29 pins), yard-ice-cpu (29 pins), yard-ice-fpga (46 pins), yard-ice-ethernet (25 pins)
GND_EARTH: yard-ice-toplevel (CN2.5 CN2.6), yard-ice-power (C1.1), yard-ice-ethernet (CN3.13)
VCC_1.5: yard-ice-power (C35.1 C43.1 L7.2 R18.2), yard-ice-fpga (10 pins)
VCC_3.3: yard-ice-toplevel (6 pins), yard-ice-power (5 pins), yard-ice-cpu (19 pins), yard-ice-fpga (9 pins), yard-ice-ethernet (7 pins)
VCC_4.7: yard-ice-toplevel (C14.1 D6.2 K1.1 U3.6), yard-ice-power (15 pins)
VCC_5V: yard-ice-toplevel (C70.1 U9.5), yard-ice-power (7 pins)
VCC_IO: yard-ice-power (C77.1 Q2.4 R34.1), yard-ice-fpga (5 pins)
ADC12_IN6: yard-ice-cpu (U6.31), yard-ice-fpga (C72.1 R44.1 R47.2)
DAC1_OUT: yard-ice-toplevel (C25.1 R12.2), yard-ice-cpu (U6.29)
DAC2_OUT: yard-ice-power (C69.1 R30.2 R31.1 U8.1), yard-ice-cpu (U6.30)
ETH_MDC: yard-ice-cpu (U6.16), yard-ice-ethernet (U4.19)
ETH_MDIO: yard-ice-cpu (R48.1 U6.25), yard-ice-ethernet (U4.18)
ETH_MII_COL: yard-ice-cpu (U6.26), yard-ice-ethernet (U4.40)
ETH_MII_CRS: yard-ice-cpu (U6.23), yard-ice-ethernet (U4.41)
ETH_MII_RX_CLK: yard-ice-cpu (U6.24), yard-ice-ethernet (U4.28)
ETH_MII_RX_DV: yard-ice-cpu (U6.32), yard-ice-ethernet (U4.27)
ETH_MII_RX_ER: yard-ice-cpu (U6.47), yard-ice-ethernet (U4.29)
ETH_MII_RXD0: yard-ice-cpu (U6.33), yard-ice-ethernet (U4.23)
ETH_MII_RXD1: yard-ice-cpu (U6.34), yard-ice-ethernet (U4.22)
ETH_MII_RXD2: yard-ice-cpu (U6.35), yard-ice-ethernet (U4.21)
ETH_MII_RXD3: yard-ice-cpu (U6.36), yard-ice-ethernet (U4.20)
ETH_MII_TX_CLK: yard-ice-cpu (U6.18), yard-ice-ethernet (U4.33)
ETH_MII_TX_EN: yard-ice-cpu (U6.48), yard-ice-ethernet (U4.34)
ETH_MII_TXD0: yard-ice-cpu (U6.51), yard-ice-ethernet (U4.35)
ETH_MII_TXD1: yard-ice-cpu (U6.52), yard-ice-ethernet (U4.36)
ETH_MII_TXD2: yard-ice-cpu (U6.17), yard-ice-ethernet (U4.38)
ETH_MII_TXD3: yard-ice-cpu (U6.95), yard-ice-ethernet (U4.39)
FSMC_CLK: yard-ice-cpu (U6.84), yard-ice-fpga (R49.2)
FSMC_D0: yard-ice-cpu (U6.61), yard-ice-fpga (U7.76)
FSMC_D1: yard-ice-cpu (U6.62), yard-ice-fpga (U7.75)
FSMC_D2: yard-ice-cpu (U6.81), yard-ice-fpga (U7.72)
FSMC_D3: yard-ice-cpu (U6.82), yard-ice-fpga (U7.71)
FSMC_D4: yard-ice-cpu (U6.38), yard-ice-fpga (U7.92)
FSMC_D5: yard-ice-cpu (U6.39), yard-ice-fpga (U7.91)
FSMC_D6: yard-ice-cpu (U6.40), yard-ice-fpga (U7.90)
FSMC_D7: yard-ice-cpu (U6.41), yard-ice-fpga (U7.89)
FSMC_D8: yard-ice-cpu (U6.42), yard-ice-fpga (U7.88)
FSMC_D9: yard-ice-cpu (U6.43), yard-ice-fpga (U7.87)
FSMC_D10: yard-ice-cpu (U6.44), yard-ice-fpga (U7.86)
FSMC_D11: yard-ice-cpu (U6.45), yard-ice-fpga (U7.85)
FSMC_D12: yard-ice-cpu (U6.46), yard-ice-fpga (U7.84)
FSMC_D13: yard-ice-cpu (U6.55), yard-ice-fpga (U7.79)
FSMC_D14: yard-ice-cpu (U6.56), yard-ice-fpga (U7.78)
FSMC_D15: yard-ice-cpu (U6.57), yard-ice-fpga (U7.77)
FSMC_NCE2: yard-ice-cpu (U6.88), yard-ice-fpga (U7.70)
FSMC_NOE: yard-ice-cpu (U6.85), yard-ice-fpga (U7.68)
FSMC_NWE: yard-ice-cpu (U6.86), yard-ice-fpga (U7.69)
I2C1_SCL: yard-ice-toplevel (C76.1 CN5.4 R25.1), yard-ice-cpu (U6.92)
I2C1_SDA: yard-ice-toplevel (C78.1 CN5.3 R23.1), yard-ice-cpu (U6.93)
JTCK: yard-ice-toplevel (P3.7), yard-ice-cpu (U6.76)
JTDI: yard-ice-toplevel (P3.3), yard-ice-cpu (U6.77)
JTDO: yard-ice-toplevel (R26.2), yard-ice-cpu (U6.89)
JTMS: yard-ice-toplevel (P3.1), yard-ice-cpu (U6.72)
JTRST: yard-ice-toplevel (P3.9), yard-ice-cpu (U6.90)
NRST: yard-ice-toplevel (P3.4), yard-ice-cpu (U6.14)
OTG_FS_DM: yard-ice-toplevel (CN2.2), yard-ice-cpu (U6.70)
OTG_FS_DP: yard-ice-toplevel (CN2.3), yard-ice-cpu (U6.71)
OTG_FS_VBUS: yard-ice-toplevel (C5.1 L1.2), yard-ice-power (D2.1), yard-ice-cpu (U6.68)
PD6: yard-ice-cpu (U6.87), yard-ice-fpga (U7.53)
PD11: yard-ice-toplevel (U9.3), yard-ice-cpu (U6.58)
PD12: yard-ice-toplevel (U9.4), yard-ice-cpu (U6.59)
PE0: yard-ice-cpu (U6.97), yard-ice-fpga (U7.16 U7.17)
PE1: yard-ice-cpu (U6.98), yard-ice-fpga (U7.6 U7.7)
PE2: yard-ice-cpu (U6.1), yard-ice-fpga (U7.8)
PE3: yard-ice-cpu (U6.2), yard-ice-fpga (U7.60)
PE4: yard-ice-cpu (U6.3), yard-ice-fpga (U7.61)
PE5: yard-ice-cpu (U6.4), yard-ice-ethernet (U4.47)
SPI2_NSS: yard-ice-toplevel (R29.2), yard-ice-cpu (U6.96)
USART5_RX: yard-ice-toplevel (P1.5 R27.1), yard-ice-cpu (U6.83)
USART5_TX: yard-ice-toplevel (R16.1), yard-ice-cpu (U6.80)
USART6_RX: yard-ice-cpu (U6.64), yard-ice-fpga (U7.51)
USART6_TX: yard-ice-cpu (U6.63), yard-ice-fpga (U7.52)